# EAGLE schematic masterV05a (EAGLE 6.1), part 1 of 2

## Sheet 1 of 11
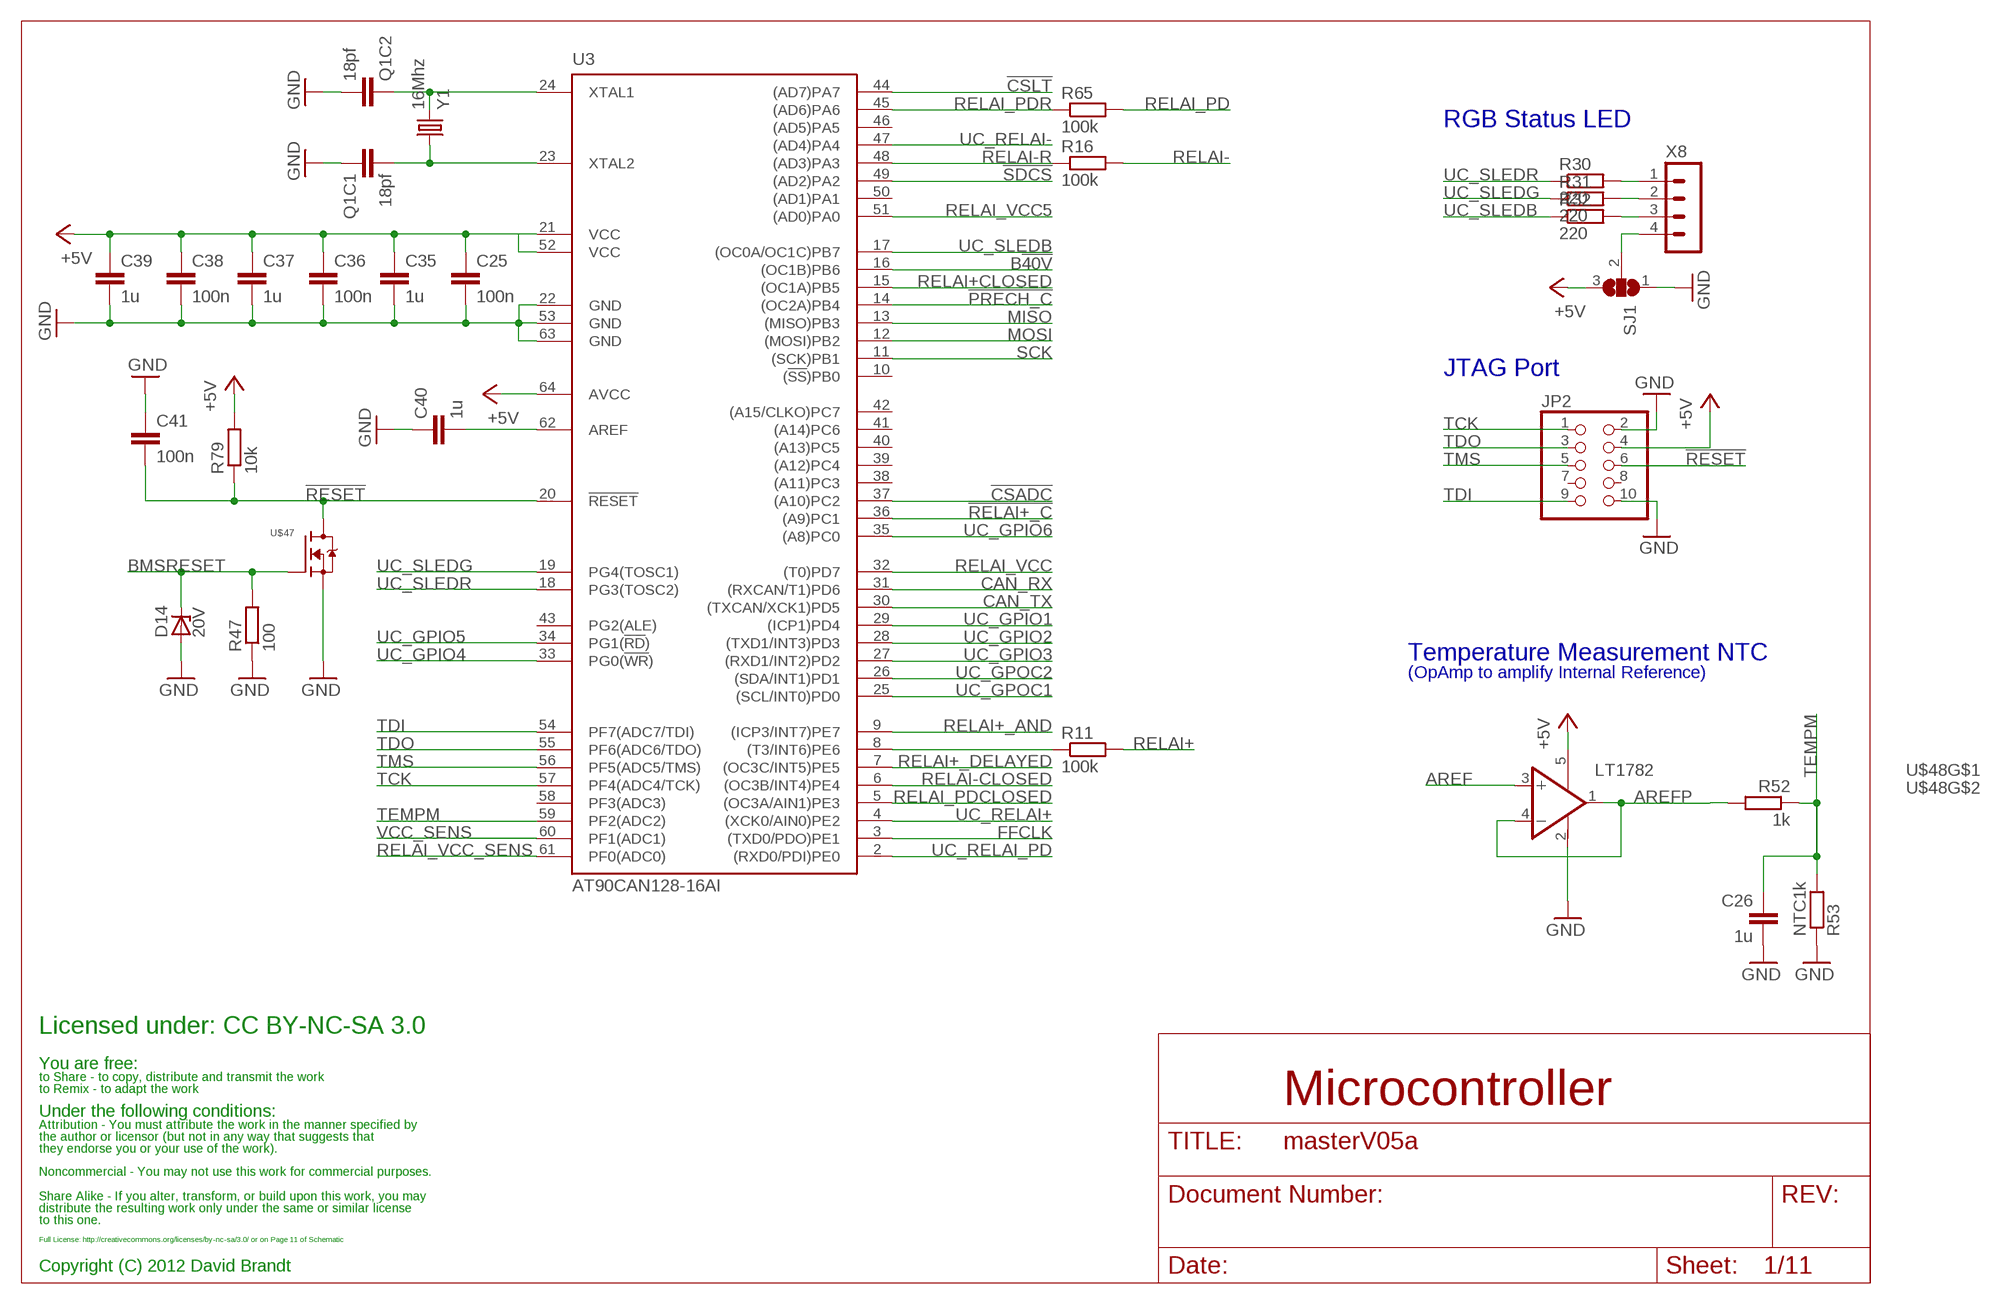
[diagram p0: schematic, sheet 1]

### Parts
C25  100n  C-EUC0603K  [C0603K]
C26  1u  C-EUC0603  [C0603]
C35  1u  C-EUC0603K  [C0603K]
C36  100n  C-EUC0603K  [C0603K]
C37  1u  C-EUC0603K  [C0603K]
C38  100n  C-EUC0603K  [C0603K]
C39  1u  C-EUC0603K  [C0603K]
C40  1u  C-EUC0603K  [C0603K]
C41  100n  C-EUC0603K  [C0603K]
D14  20V  ZENER-DIODESOD123  [SOD123]
JP2  PINHD-2X5  [2X05]
Q1C1  18pf  C-EUC0603K  [C0603K]
Q1C2  18pf  C-EUC0603K  [C0603K]
R11  100k  R-EU_R0603  [R0603]
R16  100k  R-EU_R0603  [R0603]
R30  220  R-EU_R0805  [R0805]
R31  220  R-EU_R0805  [R0805]
R32  220  R-EU_R0805  [R0805]
R47  100  R-EU_R0603  [R0603]
R52  1k  R-EU_R0603  [R0603]
R53  NTC1k  R-EU_R0603  [R0603]
R65  100k  R-EU_R0603  [R0603]
R79  10k  R-EU_R0603  [R0603]
SJ1  SJ2W  [SJ_2]
U3  AT90CAN128-16AI  [TQFP64-0.8MM]
U$47  2N7002  [SOT23]
U$48  LT1782  [SOT23-5]
X8  HEADER_POS4_43045-0412  [43045-0412]
Y1  16Mhz  CRYSTALCX-53G  [CX-53G]

### Nets
!CSADC: U3.37((A10)PC2) ; also sheet 7
!CSLT: U3.44((AD7)PA7) ; also sheet 6
!PRECH_C: U3.14((OC2A)PB4) ; also sheet 3,9
!RELAI+_C: U3.36((A9)PC1) ; also sheet 3
!RESET: C41.2 JP2.6 R79.1 U3.20(!RESET) U$47.3(D)
!SDCS: U3.49((AD2)PA2) ; also sheet 10
+5V: C25.1 C35.1 C36.1 C37.1 C38.1 C39.1 JP2.4 R79.2 SJ1.3 U3.21(VCC) U3.52(VCC) U3.64(AVCC) U$48.5(V+) ; also sheet 2,3,4,5,6,7,8,9,10
AREF: C40.2 U3.62(AREF) U$48.3(+IN)
AREFP: R52.2 U$48.1(OUT) U$48.4(-IN)
B!40V: U3.16((OC1B)PB6) ; also sheet 3,4,8
BMSRESET: D14.C R47.2 U$47.1(G) ; also sheet 2
CAN_RX: U3.31((RXCAN/T1)PD6) ; also sheet 5
CAN_TX: U3.30((TXCAN/XCK1)PD5) ; also sheet 5
FFCLK: U3.3((TXD0/PDO)PE1) ; also sheet 3
GND: C25.2 C26.2 C35.2 C36.2 C37.2 C38.2 C39.2 C40.1 C41.1 D14.A JP2.2 JP2.10 Q1C1.1 Q1C2.2 R47.1 R53.1 SJ1.1 U3.22(GND) U3.53(GND) U3.63(GND) U$47.2(S) U$48.2(V-) ; also sheet 2,3,4,5,6,7,8,9,10
MISO: U3.13((MISO)PB3) ; also sheet 6,7,10
MOSI: U3.12((MOSI)PB2) ; also sheet 6,10
OSC1: Q1C2.1 U3.24(XTAL1) Y1.P$2
OSC2: Q1C1.2 U3.23(XTAL2) Y1.P$1
RELAI+: R11.2 ; also sheet 3,4
RELAI+_AND: U3.9((ICP3/INT7)PE7) ; also sheet 3
RELAI+_DELAYED: U3.7((OC3C/INT5)PE5) ; also sheet 3
RELAI+CLOSED: U3.15((OC1A)PB5) ; also sheet 4
RELAI+S: R11.1 U3.8((T3/INT6)PE6)
RELAI-: R16.2 ; also sheet 3,4
RELAI-CLOSED: U3.6((OC3B/INT4)PE4) ; also sheet 3,4
RELAI-R: R16.1 U3.48((AD3)PA3)
RELAI_PD: R65.2 ; also sheet 3,4
RELAI_PDCLOSED: U3.5((OC3A/AIN1)PE3) ; also sheet 3,4
RELAI_PDR: R65.1 U3.45((AD6)PA6)
RELAI_VCC: U3.32((T0)PD7)
RELAI_VCC5: U3.51((AD0)PA0) ; also sheet 2,3
RELAI_VCC_SENS: U3.61(PF0(ADC0)) ; also sheet 2
SCK: U3.11((SCK)PB1) ; also sheet 6,7,10
SLEDB: R32.2 X8.3
SLEDG: R31.2 X8.2
SLEDPOW: SJ1.2 X8.4
SLEDR: R30.2 X8.1
TCK: JP2.1 U3.57(PF4(ADC4/TCK))
TDI: JP2.9 U3.54(PF7(ADC7/TDI))
TDO: JP2.3 U3.55(PF6(ADC6/TDO))
TEMPM: C26.1 R52.1 R53.2 U3.59(PF2(ADC2))
TMS: JP2.5 U3.56(PF5(ADC5/TMS))
UC_GPIO1: U3.29((ICP1)PD4) ; also sheet 2
UC_GPIO2: U3.28((TXD1/INT3)PD3) ; also sheet 2
UC_GPIO3: U3.27((RXD1/INT2)PD2) ; also sheet 2
UC_GPIO4: U3.33(PG0(!WR!)) ; also sheet 2
UC_GPIO5: U3.34(PG1(!RD!)) ; also sheet 2
UC_GPIO6: U3.35((A8)PC0) ; also sheet 2
UC_GPOC1: U3.25((SCL/INT0)PD0) ; also sheet 2
UC_GPOC2: U3.26((SDA/INT1)PD1) ; also sheet 2
UC_RELAI+: U3.4((XCK0/AIN0)PE2) ; also sheet 3
UC_RELAI-: U3.47((AD4)PA4) ; also sheet 3
UC_RELAI_PD: U3.2((RXD0/PDI)PE0) ; also sheet 3
UC_SLEDB: R32.1 U3.17((OC0A/OC1C)PB7)
UC_SLEDG: R31.1 U3.19(PG4(TOSC1))
UC_SLEDR: R30.1 U3.18(PG3(TOSC2))
VCC_SENS: U3.60(PF1(ADC1)) ; also sheet 2
Unconnected: JP2.7 JP2.8 U3.10((!SS!)PB0) U3.38((A11)PC3) U3.39((A12)PC4) U3.40((A13)PC5) U3.41((A14)PC6) U3.42((A15/CLKO)PC7) U3.43(PG2(ALE)) U3.46((AD5)PA5) U3.50((AD1)PA1) U3.58(PF3(ADC3))

### Notes on the sheet
- RGB Status LED
- JTAG Port
- Temperature Measurement NTC
- (OpAmp to amplify Internal Reference)
- Licensed under: CC BY-NC-SA 3.0
- You are free:
- to Share - to copy, distribute and transmit the work
- to Remix - to adapt the work
- Microcontroller
- Under the following conditions:
- Attribution - You must attribute the work in the manner specified by
- the author or licensor (but not in any way that suggests that
- they endorse you or your use of the work).
- Noncommercial - You may not use this work for commercial purposes.
- Share Alike - If you alter, transform, or build upon this work, you may
- distribute the resulting work only under the same or similar license
- to this one.
- Full License: http://creativecommons.org/licenses/by-nc-sa/3.0/ or on Page 11 of Schematic
- Copyright (C) 2012 David Brandt

## Sheet 2 of 11
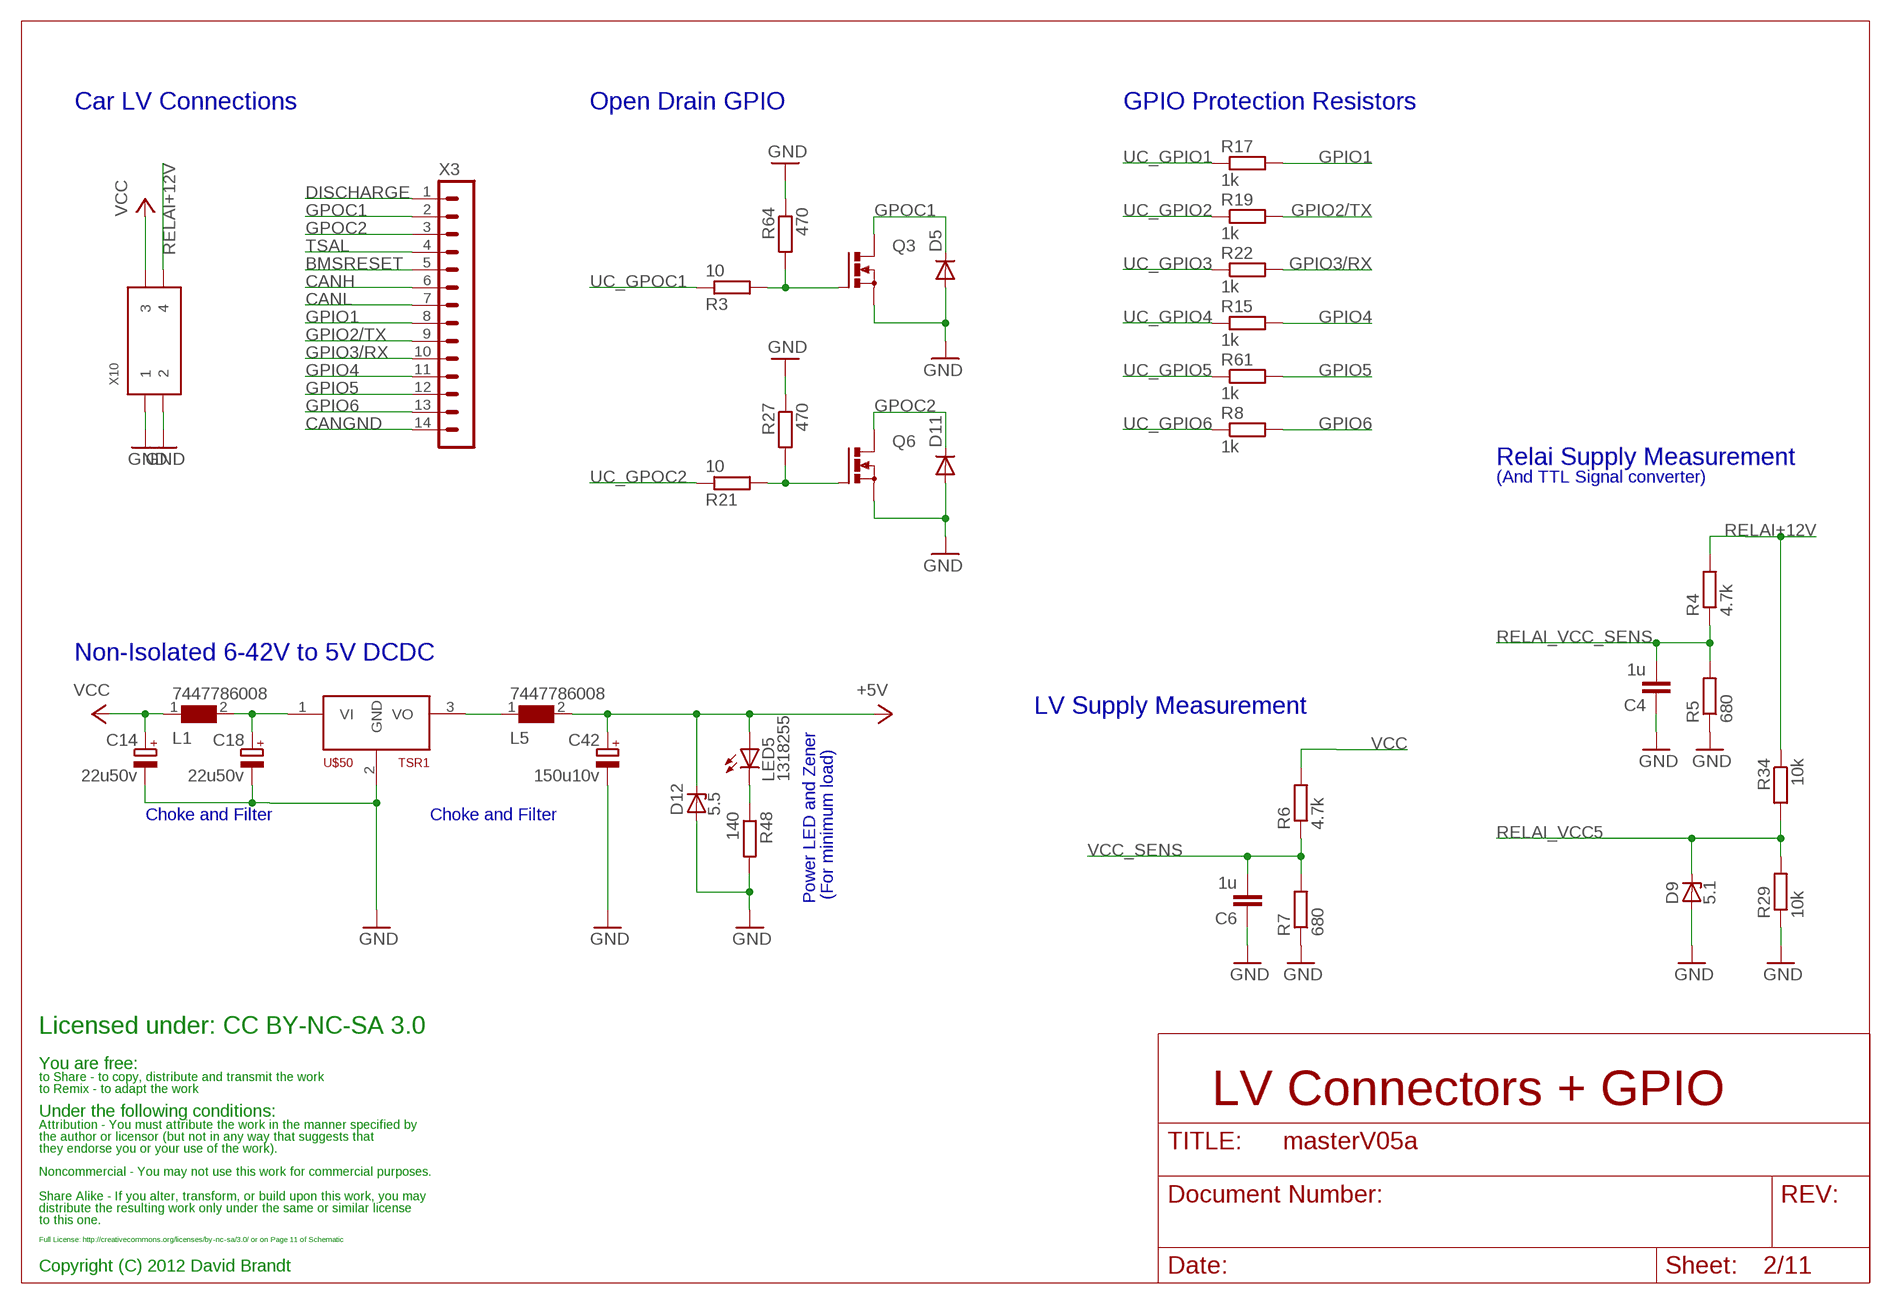
[diagram p1: schematic, sheet 2]

### Parts
C4  1u  C-EUC0603  [C0603]
C6  1u  C-EUC0603  [C0603]
C14  22u50v  CPOL-EUD  [PANASONIC_D]
C18  22u50v  CPOL-EUD  [PANASONIC_D]
C42  150u10v  CPOL-EUD  [PANASONIC_D]
D5  DIODE-SMB  [SMB]
D9  5.1  ZENER-DIODESOD323  [SOD323-W]
D11  DIODE-SMB  [SMB]
D12  5.5  ZENER-DIODESOD323  [SOD323-W]
L1  7447786008  WE-PD_6033/6050_PLASTIC_BASE  [WE-PD_6033/6050_PLASTIC_BASE]
L5  7447786008  WE-PD_6033/6050_PLASTIC_BASE  [WE-PD_6033/6050_PLASTIC_BASE]
LED5  1318255  LEDCHIPLED_1206  [CHIPLED_1206]
Q3  N-MOSFET-SO8S  [SO-08]
Q6  N-MOSFET-SO8S  [SO-08]
R3  10  R-EU_R0603  [R0603]
R4  4.7k  R-EU_R0603  [R0603]
R5  680  R-EU_R0603  [R0603]
R6  4.7k  R-EU_R0603  [R0603]
R7  680  R-EU_R0603  [R0603]
R8  1k  R-EU_R0603  [R0603]
R15  1k  R-EU_R0603  [R0603]
R17  1k  R-EU_R0603  [R0603]
R19  1k  R-EU_R0603  [R0603]
R21  10  R-EU_R0603  [R0603]
R22  1k  R-EU_R0603  [R0603]
R27  470  R-EU_R0603  [R0603]
R29  10k  R-EU_R0603  [R0603]
R34  10k  R-EU_R0603  [R0603]
R48  140  R-EU_R1206  [R1206]
R61  1k  R-EU_R0603  [R0603]
R64  470  R-EU_R0603  [R0603]
U$50  TSR1  [TSR1]
X3  HEADER_POS14_43045-1412  [43045-1412]
X10  MINI-FIT-JR-045566  [5566-04]

### Nets
+5V: C42.+ D12.C L5.2 LED5.A ; also sheet 1,3,4,5,6,7,8,9,10
+5VL: L5.1 U$50.3(VO)
BMSRESET: X3.5 ; also sheet 1
CANGND: X3.14 ; also sheet 5
CANH: X3.6 ; also sheet 5
CANL: X3.7 ; also sheet 5
DISCHARGE: X3.1 ; also sheet 4
GND: C4.1 C6.1 C14.- C18.- C42.- D5.A D9.A D11.A D12.A Q3.1(S) Q3.2(S) Q3.3(S) Q6.1(S) Q6.2(S) Q6.3(S) R5.1 R7.1 R27.1 R29.1 R48.2 R64.1 U$50.2(GND) X10.P1 X10.P2 ; also sheet 1,3,4,5,6,7,8,9,10
GPIO1: R17.2 X3.8
GPIO2/TX: R19.2 X3.9
GPIO3/RX: R22.2 X3.10
GPIO4: R15.2 X3.11
GPIO5: R61.2 X3.12
GPIO6: R8.2 X3.13
GPOC1: D5.C Q3.5(D) Q3.6(D) Q3.7(D) Q3.8(D) X3.2
GPOC2: D11.C Q6.5(D) Q6.6(D) Q6.7(D) Q6.8(D) X3.3
PLEDC5: LED5.C R48.1
RELAI+12V: R4.2 R34.1 X10.P4 ; also sheet 4
RELAI_VCC5: D9.C R29.2 R34.2 ; also sheet 1,3
RELAI_VCC_SENS: C4.2 R4.1 R5.2 ; also sheet 1
RELAIPDG1: Q3.4(G) R3.2 R64.2
RELAIPDG2: Q6.4(G) R21.2 R27.2
TSAL: X3.4 ; also sheet 4
UC_GPIO1: R17.1 ; also sheet 1
UC_GPIO2: R19.1 ; also sheet 1
UC_GPIO3: R22.1 ; also sheet 1
UC_GPIO4: R15.1 ; also sheet 1
UC_GPIO5: R61.1 ; also sheet 1
UC_GPIO6: R8.1 ; also sheet 1
UC_GPOC1: R3.1 ; also sheet 1
UC_GPOC2: R21.1 ; also sheet 1
VCC: C14.+ L1.1 R6.2 X10.P3
VCC2: C18.+ L1.2 U$50.1(VI)
VCC_SENS: C6.2 R6.1 R7.2 ; also sheet 1

### Notes on the sheet
- Car LV Connections | Open Drain GPIO | GPIO Protection Resistors
- Relai Supply Measurement
- (And TTL Signal converter)
- Non-Isolated 6-42V to 5V DCDC
- LV Supply Measurement
- Power LED and Zener
- (For minimum load)
- Choke and Filter | Choke and Filter
- Licensed under: CC BY-NC-SA 3.0
- You are free:
- to Share - to copy, distribute and transmit the work
- to Remix - to adapt the work
- LV Connectors + GPIO
- Under the following conditions:
- Attribution - You must attribute the work in the manner specified by
- the author or licensor (but not in any way that suggests that
- they endorse you or your use of the work).
- Noncommercial - You may not use this work for commercial purposes.
- Share Alike - If you alter, transform, or build upon this work, you may
- distribute the resulting work only under the same or similar license
- to this one.
- Full License: http://creativecommons.org/licenses/by-nc-sa/3.0/ or on Page 11 of Schematic
- Copyright (C) 2012 David Brandt

## Sheet 3 of 11
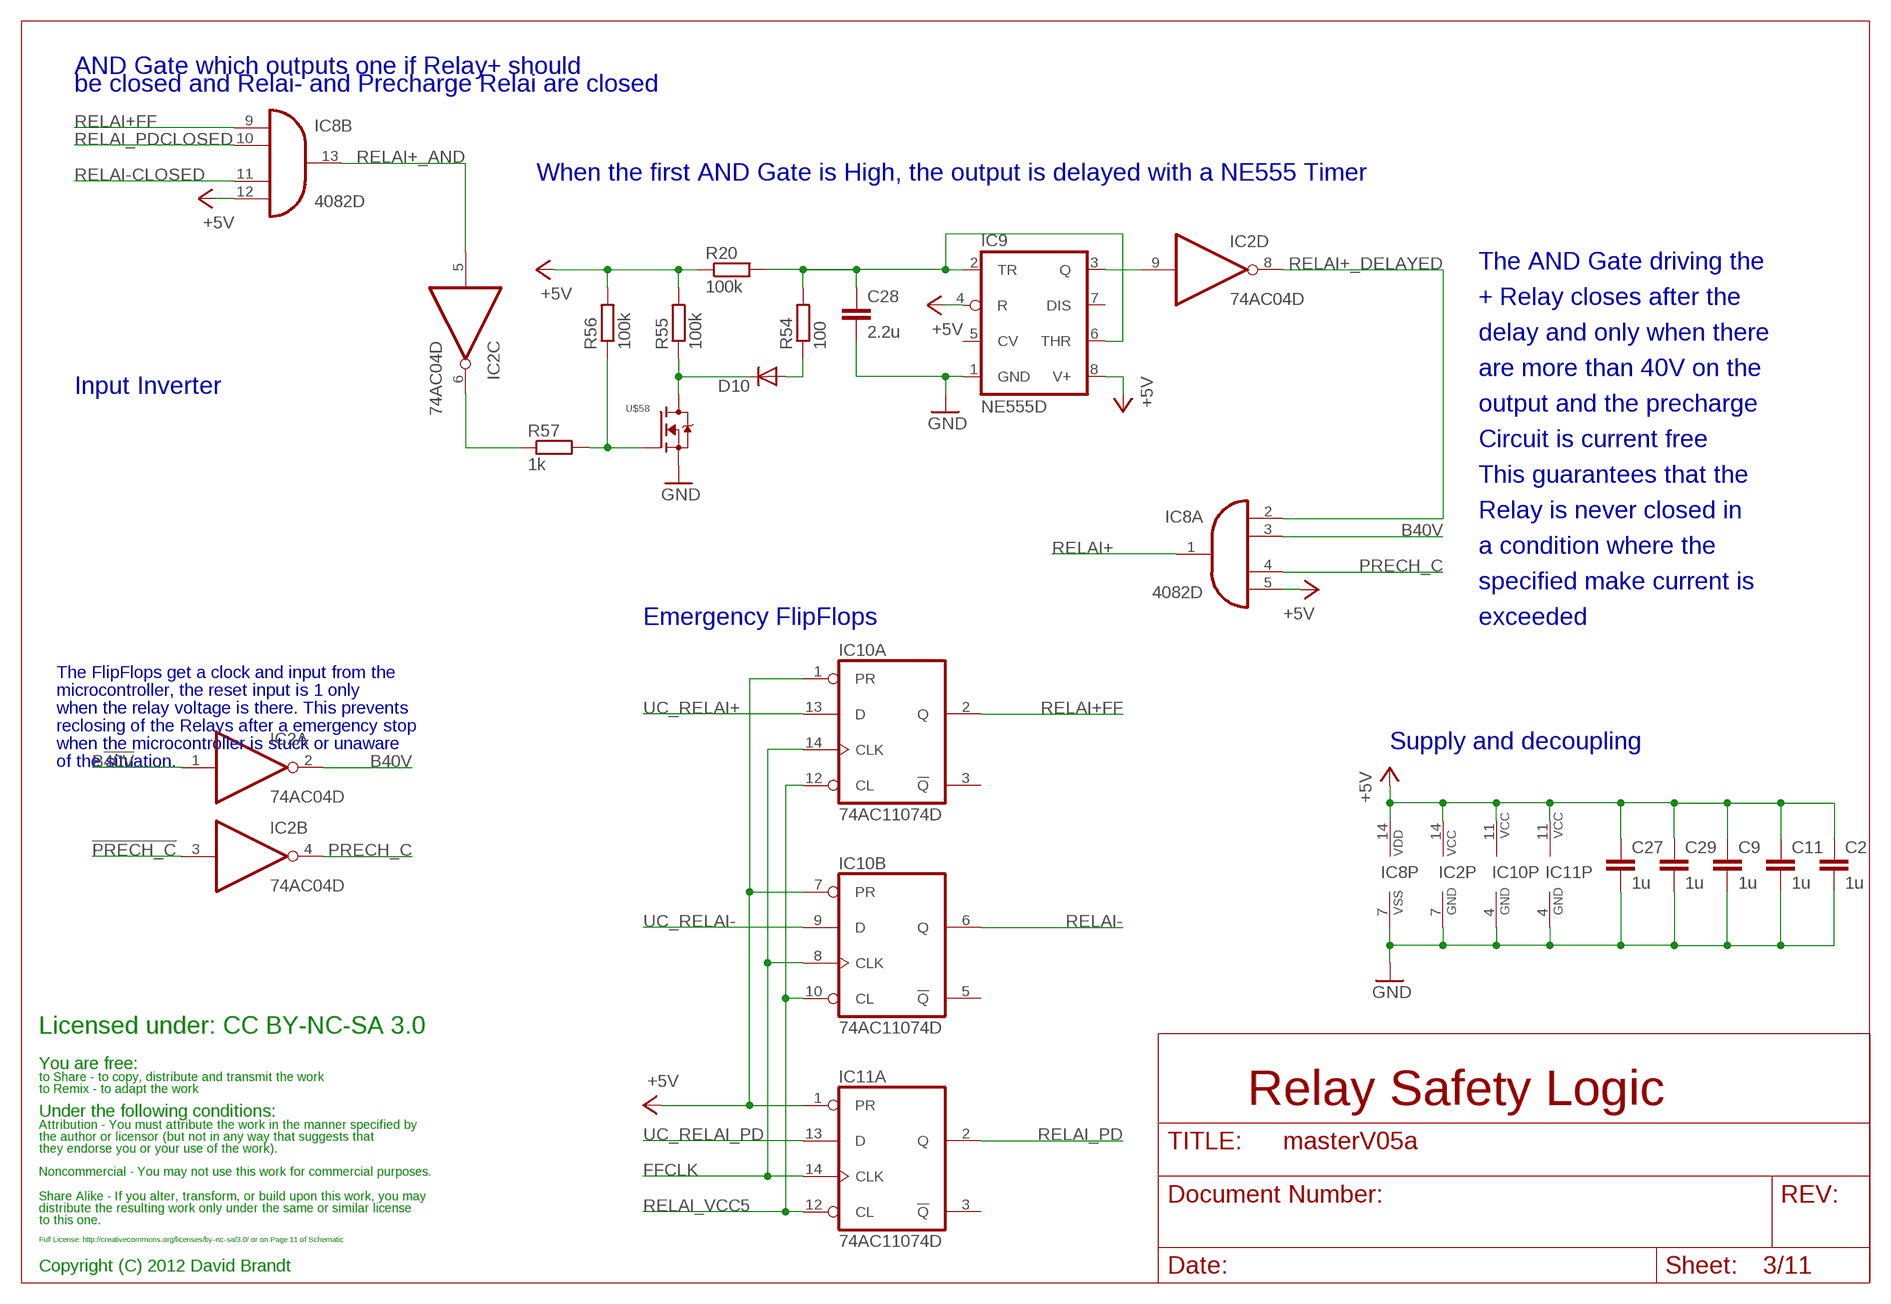
[diagram p2: schematic, sheet 3]

### Parts
C2  1u  C-EUC0603  [C0603]
C9  1u  C-EUC0603  [C0603]
C11  1u  C-EUC0603  [C0603]
C27  1u  C-EUC0603  [C0603]
C28  2.2u  C-EUC1206K  [C1206K]
C29  1u  C-EUC0603  [C0603]
D10  DIODE-SOD323-W  [SOD323-W]
IC2  74AC04D  [SO14]
IC8  4082D  [SO14]
IC9  NE555D  [SO08]
IC10  74AC11074D  [SO14]
IC11  74AC11074D  [SO14]
R20  100k  R-EU_R0603  [R0603]
R54  100  R-EU_R0603  [R0603]
R55  100k  R-EU_R0603  [R0603]
R56  100k  R-EU_R0603  [R0603]
R57  1k  R-EU_R0603  [R0603]
U$58  2N7002  [SOT23]

### Nets
!ANDOUT2: D10.C R55.1 U$58.3(D)
!PRECH_C: IC2.3(B:I) ; also sheet 1,9
!RELAI+_C: IC2.6(C:O) R57.1 ; also sheet 1
!RELAI+_CC: IC2.9(D:I) IC9.3(Q)
+5V: C2.1 C9.1 C11.1 C27.1 C29.1 IC2.14(P:VCC) IC8.5(A:I3) IC8.12(B:I3) IC8.14(P:VDD) IC9.4(R) IC9.8(V+) IC10.1(A:PR) IC10.7(B:PR) IC10.11(P:VCC) IC11.1(A:PR) IC11.11(P:VCC) R20.1 R55.2 R56.2 ; also sheet 1,2,4,5,6,7,8,9,10
ANDOUTD: D10.A R54.1
B40V: IC2.2(A:O) IC8.3(A:I1)
B!40V: IC2.1(A:I) ; also sheet 1,4,8
FFCLK: IC10.8(B:CLK) IC10.14(A:CLK) IC11.14(A:CLK) ; also sheet 1
GND: C2.2 C9.2 C11.2 C27.2 C28.2 C29.2 IC2.7(P:GND) IC8.7(P:VSS) IC9.1(GND) IC10.4(P:GND) IC11.4(P:GND) U$58.2(S) ; also sheet 1,2,4,5,6,7,8,9,10
NE555_TR: C28.1 IC9.2(TR) IC9.6(THR) R20.2 R54.2
PRECH_C: IC2.4(B:O) IC8.4(A:I2)
RELAI+: IC8.1(A:O) ; also sheet 1,4
RELAI+_AND: IC2.5(C:I) IC8.13(B:O) ; also sheet 1
RELAI+_CG: R56.1 R57.2 U$58.1(G)
RELAI+_DELAYED: IC2.8(D:O) IC8.2(A:I0) ; also sheet 1
RELAI+FF: IC8.9(B:I0) IC10.2(A:Q)
RELAI-: IC10.6(B:Q) ; also sheet 1,4
RELAI-CLOSED: IC8.11(B:I2) ; also sheet 1,4
RELAI_PD: IC11.2(A:Q) ; also sheet 1,4
RELAI_PDCLOSED: IC8.10(B:I1) ; also sheet 1,4
RELAI_VCC5: IC10.10(B:CL) IC10.12(A:CL) IC11.12(A:CL) ; also sheet 1,2
UC_RELAI+: IC10.13(A:D) ; also sheet 1
UC_RELAI-: IC10.9(B:D) ; also sheet 1
UC_RELAI_PD: IC11.13(A:D) ; also sheet 1
Unconnected: IC2.10(E:O) IC2.11(E:I) IC2.12(F:O) IC2.13(F:I) IC9.5(CV) IC9.7(DIS) IC10.3(A:!Q) IC10.5(B:!Q) IC11.3(A:!Q) IC11.5(B:!Q) IC11.6(B:Q) IC11.7(B:PR) IC11.8(B:CLK) IC11.9(B:D) IC11.10(B:CL)

### Notes on the sheet
- AND Gate which outputs one if Relay+ should
- be closed and Relai- and Precharge Relai are closed
- When the first AND Gate is High, the output is delayed with a NE555 Timer
- The AND Gate driving the
- + Relay closes after the
- delay and only when there
- are more than 40V on the
- Input Inverter
- output and the precharge
- Circuit is current free
- This guarantees that the
- Relay is never closed in
- a condition where the
- specified make current is
- Emergency FlipFlops | exceeded
- The FlipFlops get a clock and input from the
- microcontroller, the reset input is 1 only
- when the relay voltage is there. This prevents
- reclosing of the Relays after a emergency stop
- when the microcontroller is stuck or unaware | Supply and decoupling
- of the situation.
- Licensed under: CC BY-NC-SA 3.0
- You are free:
- to Share - to copy, distribute and transmit the work
- to Remix - to adapt the work
- Relay Safety Logic
- Under the following conditions:
- Attribution - You must attribute the work in the manner specified by
- the author or licensor (but not in any way that suggests that
- they endorse you or your use of the work).
- Noncommercial - You may not use this work for commercial purposes.
- Share Alike - If you alter, transform, or build upon this work, you may
- distribute the resulting work only under the same or similar license
- to this one.
- Full License: http://creativecommons.org/licenses/by-nc-sa/3.0/ or on Page 11 of Schematic
- Copyright (C) 2012 David Brandt

## Sheet 4 of 11
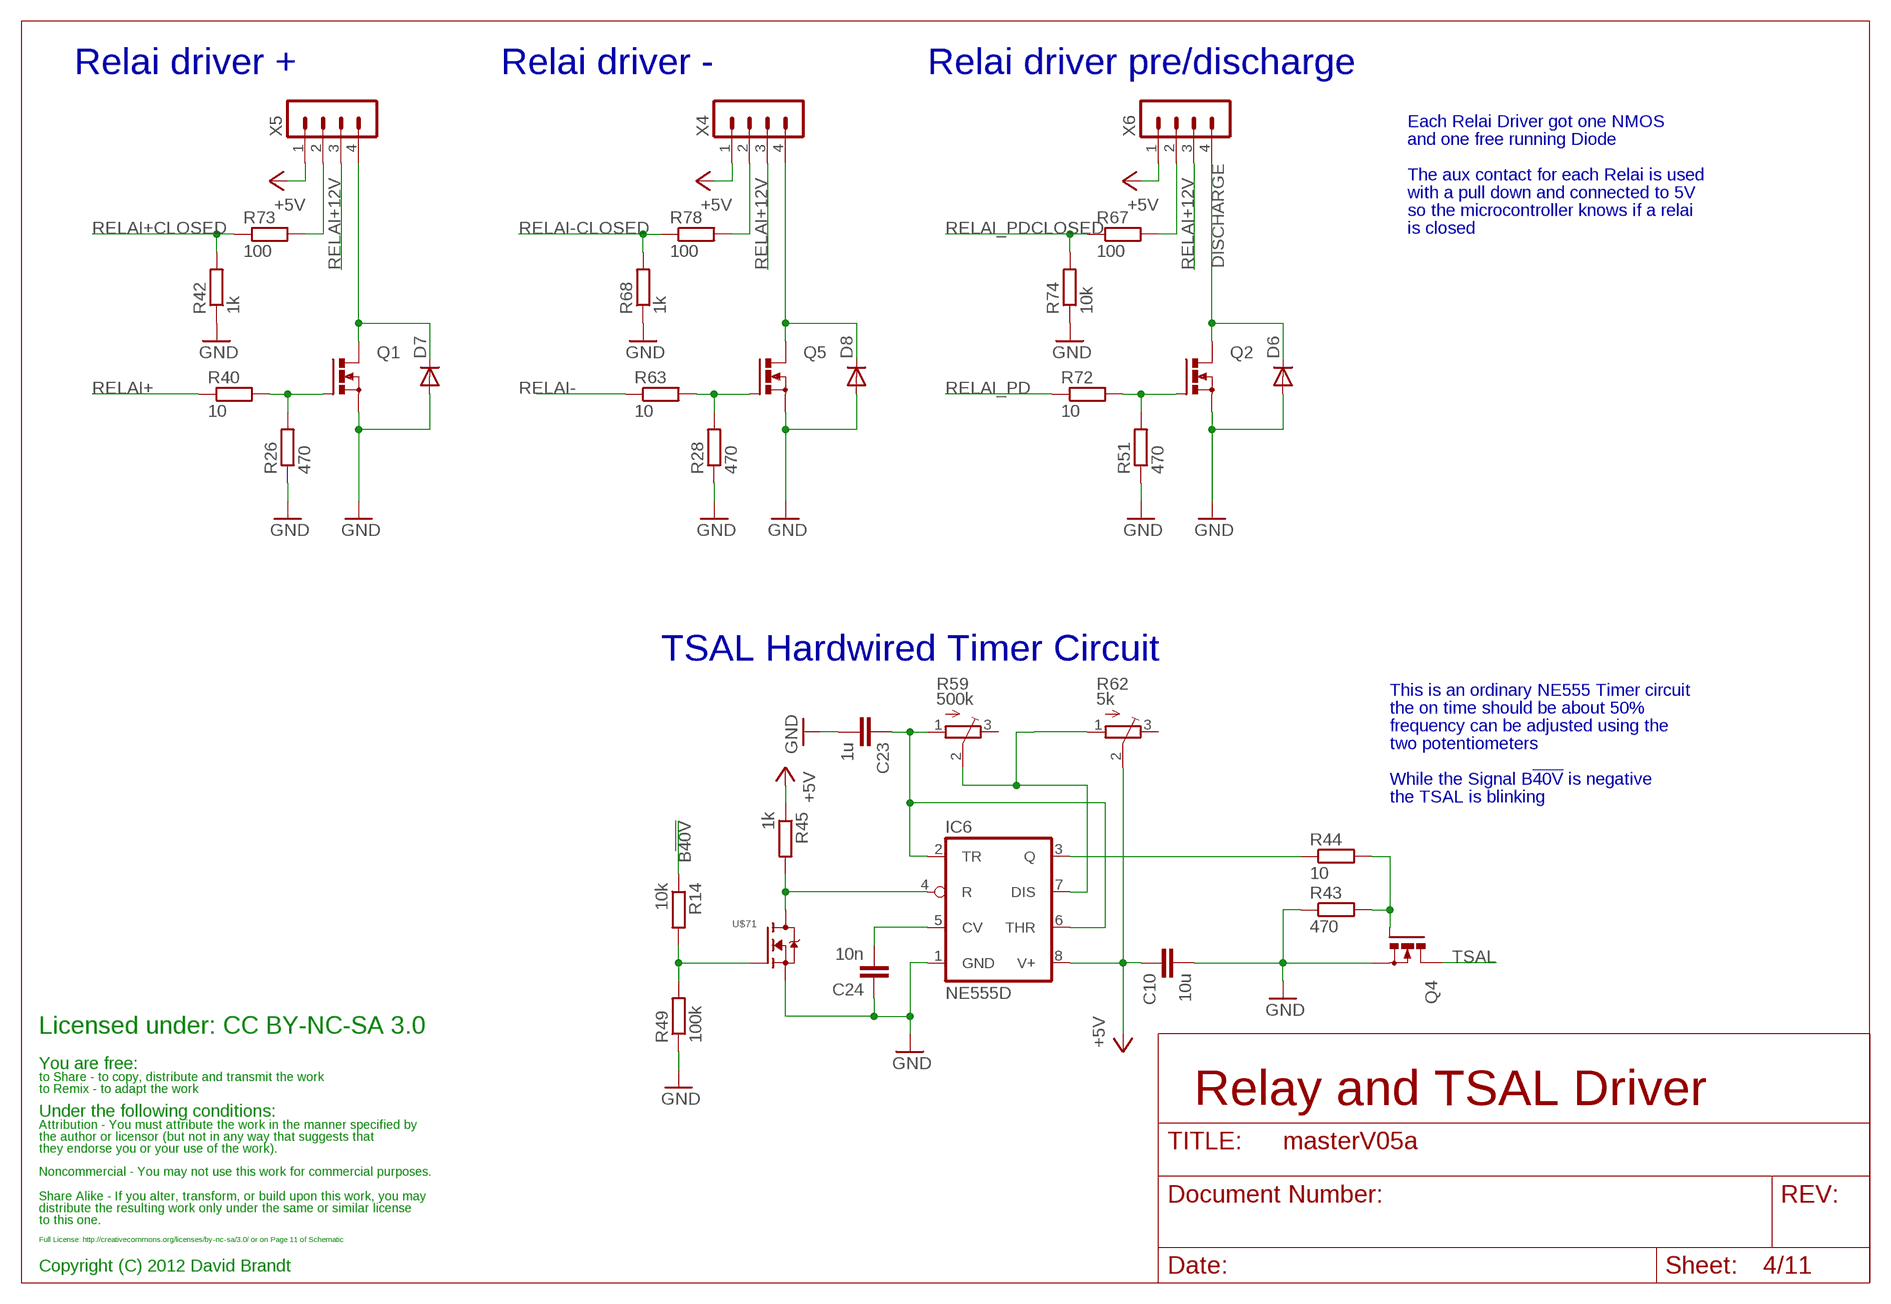
[diagram p3: schematic, sheet 4]

### Parts
C10  10u  C-EUC1206K  [C1206K]
C23  1u  C-EUC0805K  [C0805K]
C24  10n  C-EUC0603  [C0603]
D6  DIODE-SMB  [SMB]
D7  DIODE-SMB  [SMB]
D8  DIODE-SMB  [SMB]
IC6  NE555D  [SO08]
Q1  N-MOSFET-SO8S  [SO-08]
Q2  N-MOSFET-SO8S  [SO-08]
Q4  N-MOSFET-SO8S  [SO-08]
Q5  N-MOSFET-SO8S  [SO-08]
R14  10k  R-EU_R0603  [R0603]
R26  470  R-EU_R0603  [R0603]
R28  470  R-EU_R0603  [R0603]
R40  10  R-EU_R0603  [R0603]
R42  1k  R-EU_R0603  [R0603]
R43  470  R-EU_R0603  [R0603]
R44  10  R-EU_R0603  [R0603]
R45  1k  R-EU_R0603  [R0603]
R49  100k  R-EU_R0603  [R0603]
R51  470  R-EU_R0603  [R0603]
R59  500k  TRIM_EU-3223W  [3223W]
R62  5k  TRIM_EU-3223W  [3223W]
R63  10  R-EU_R0603  [R0603]
R67  100  R-EU_R0603  [R0603]
R68  1k  R-EU_R0603  [R0603]
R72  10  R-EU_R0603  [R0603]
R73  100  R-EU_R0603  [R0603]
R74  10k  R-EU_R0603  [R0603]
R78  100  R-EU_R0603  [R0603]
U$71  2N7002  [SOT23]
X4  HEADER_POS4_43045-0412  [43045-0412]
X5  HEADER_POS4_43045-0412  [43045-0412]
X6  HEADER_POS4_43045-0412  [43045-0412]

### Nets
+5V: C10.1 IC6.8(V+) R45.1 R62.2(S) X4.1 X5.1 X6.1 ; also sheet 1,2,3,5,6,7,8,9,10
B!40V: R14.1 ; also sheet 1,3,8
DISCHARGE: D6.C Q2.5(D) Q2.6(D) Q2.7(D) Q2.8(D) X6.4 ; also sheet 2
GND: C10.2 C23.2 C24.1 D6.A D7.A D8.A IC6.1(GND) Q1.1(S) Q1.2(S) Q1.3(S) Q2.1(S) Q2.2(S) Q2.3(S) Q4.1(S) Q4.2(S) Q4.3(S) Q5.1(S) Q5.2(S) Q5.3(S) R26.1 R28.1 R42.1 R43.1 R49.1 R51.1 R68.1 R74.1 U$71.2(S) ; also sheet 1,2,3,5,6,7,8,9,10
RELAI+: R40.1 ; also sheet 1,3
RELAI+12V: X4.3 X5.3 X6.3 ; also sheet 2
RELAI+_CLOSED_AP: R73.2 X5.2
RELAI+CLOSED: R42.2 R73.1 ; also sheet 1
RELAI+G: Q1.4(G) R26.2 R40.2
RELAI+GND: D7.C Q1.5(D) Q1.6(D) Q1.7(D) Q1.8(D) X5.4
RELAI-: R63.1 ; also sheet 1,3
RELAI-_CLOSED_AP: R78.2 X4.2
RELAI-CLOSED: R68.2 R78.1 ; also sheet 1,3
RELAI-G: Q5.4(G) R28.2 R63.2
RELAI-GND: D8.C Q5.5(D) Q5.6(D) Q5.7(D) Q5.8(D) X4.4
RELAI_PD: R72.1 ; also sheet 1,3
RELAI_PDCLOSED: R67.1 R74.2 ; also sheet 1,3
RELAIPD_CLOSED_AP: R67.2 X6.2
RELAIPDG: Q2.4(G) R51.2 R72.2
TSAL: Q4.5(D) Q4.6(D) Q4.7(D) Q4.8(D) ; also sheet 2
TSAL!R: IC6.4(R) R45.2 U$71.3(D)
TSALCV: C24.2 IC6.5(CV)
TSALDIS: IC6.7(DIS) R59.2(S) R62.1(A)
TSALG: Q4.4(G) R43.2 R44.2
TSALGOUT: R14.2 R49.2 U$71.1(G)
TSALPR: C23.1 IC6.2(TR) IC6.6(THR) R59.1(A)
TSALQ: IC6.3(Q) R44.1
Unconnected: R59.3(E) R62.3(E)

### Notes on the sheet
- Relai driver + | Relai driver - | Relai driver pre/discharge
- Each Relai Driver got one NMOS
- and one free running Diode
- The aux contact for each Relai is used
- with a pull down and connected to 5V
- so the microcontroller knows if a relai
- is closed
- TSAL Hardwired Timer Circuit
- This is an ordinary NE555 Timer circuit
- the on time should be about 50%
- frequency can be adjusted using the
- two potentiometers
- While the Signal B!40V! is negative
- the TSAL is blinking
- Licensed under: CC BY-NC-SA 3.0
- You are free:
- to Share - to copy, distribute and transmit the work
- to Remix - to adapt the work
- Relay and TSAL Driver
- Under the following conditions:
- Attribution - You must attribute the work in the manner specified by
- the author or licensor (but not in any way that suggests that
- they endorse you or your use of the work).
- Noncommercial - You may not use this work for commercial purposes.
- Share Alike - If you alter, transform, or build upon this work, you may
- distribute the resulting work only under the same or similar license
- to this one.
- Full License: http://creativecommons.org/licenses/by-nc-sa/3.0/ or on Page 11 of Schematic
- Copyright (C) 2012 David Brandt

## Sheet 5 of 11
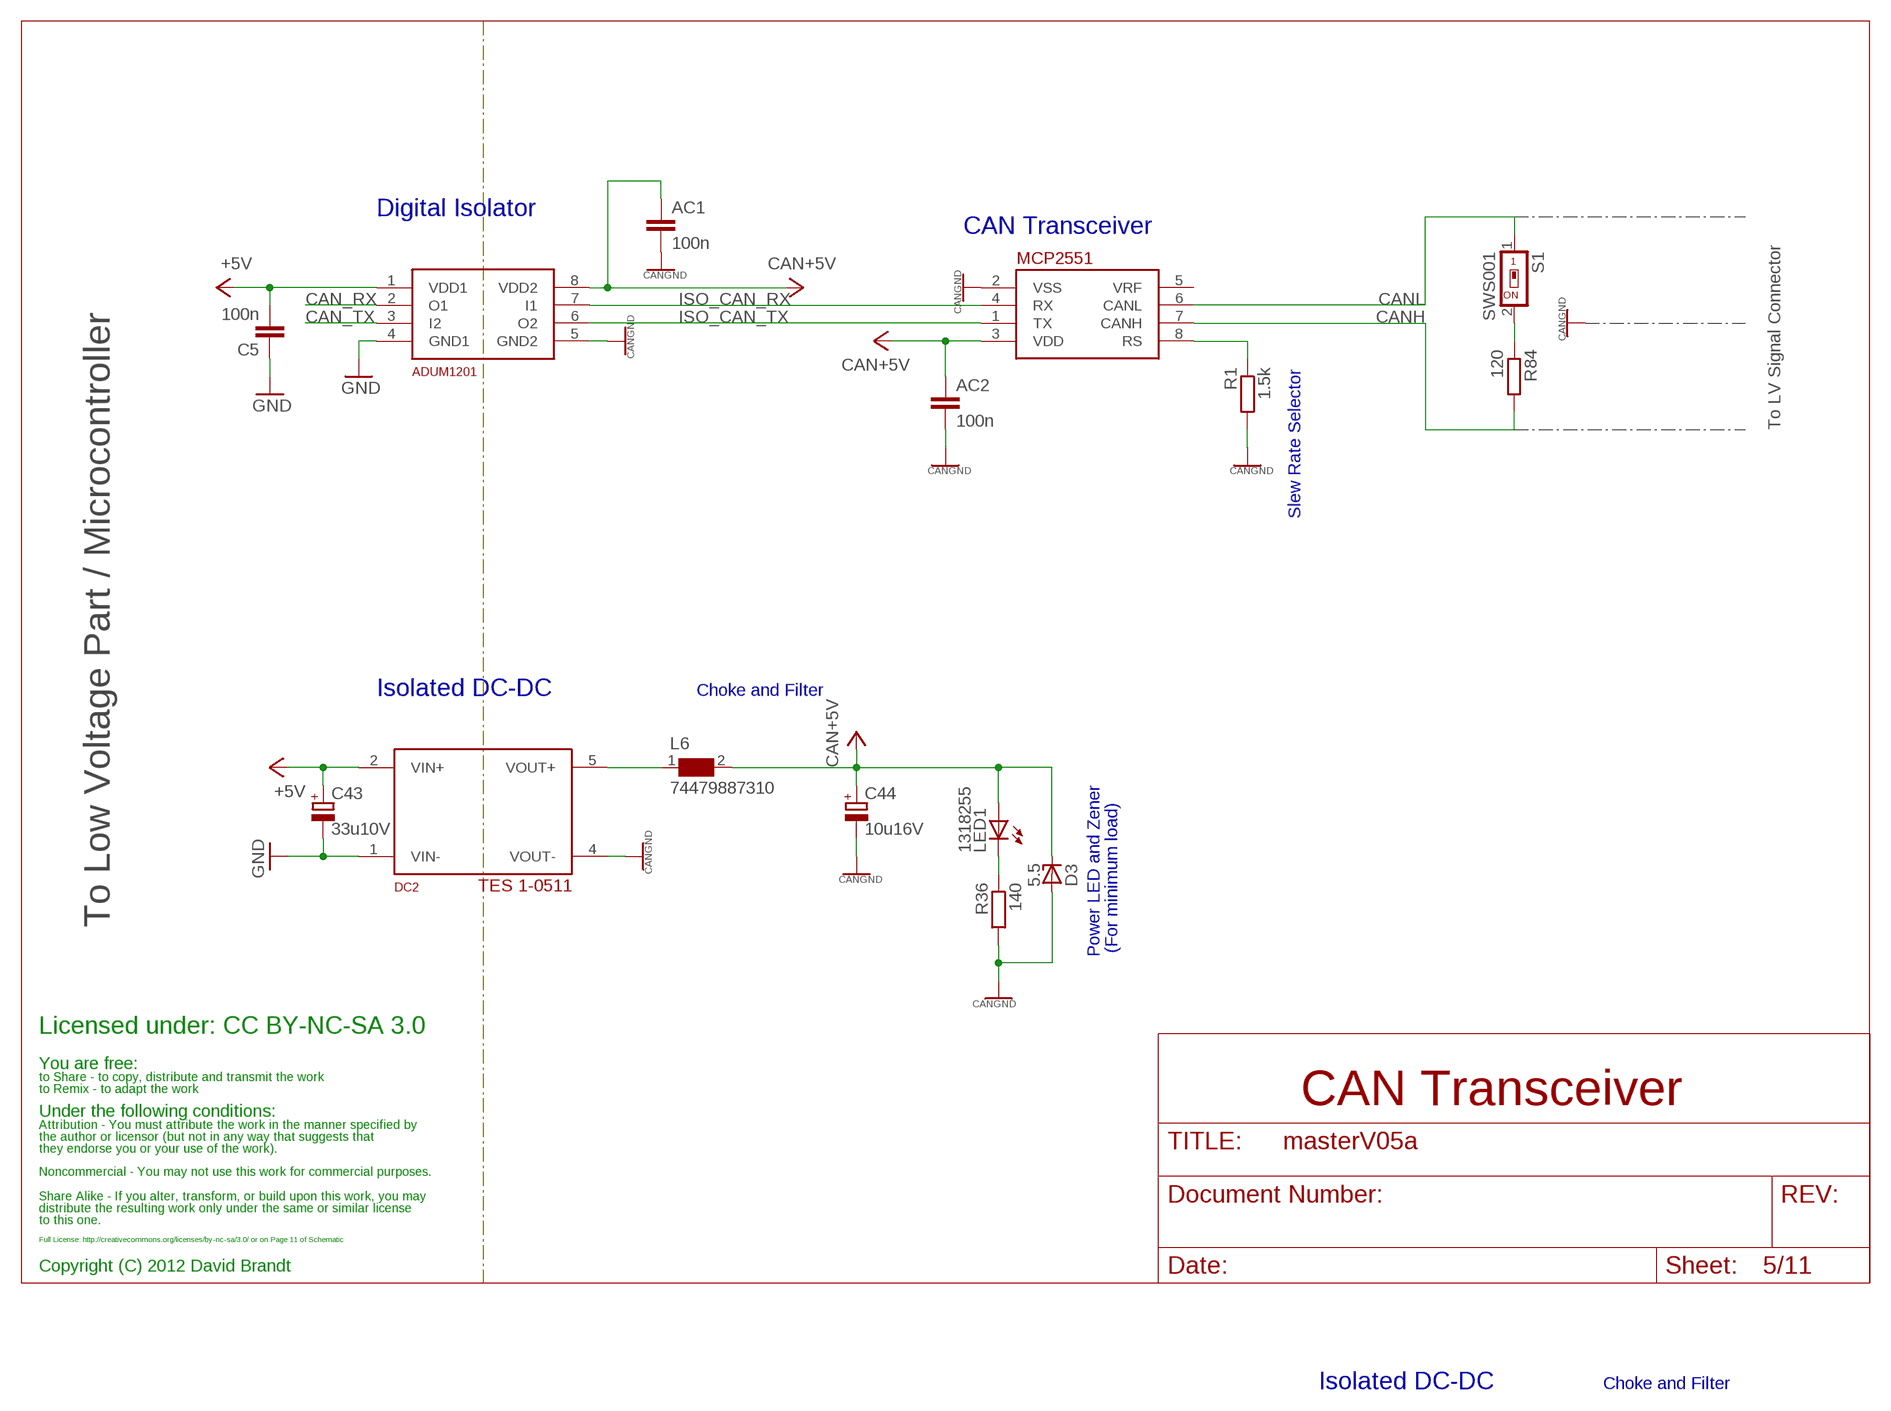
[diagram p4: schematic, sheet 5]

### Parts
AC1  100n  C-EUC0603K  [C0603K]
AC2  100n  C-EUC0603K  [C0603K]
C5  100n  C-EUC0603K  [C0603K]
C43  33u10V  CPOL-EUC  [PANASONIC_C]
C44  10u16V  CPOL-EUB  [PANASONIC_B]
D3  5.5  ZENER-DIODESOD323  [SOD323-W]
DC2  TES 1-0511  ISFXXXXA  [ISF]
L6  74479887310  WE-PMI_1008  [WE-PMI_1008]
LED1  1318255  LEDCHIPLED_1206  [CHIPLED_1206]
R1  1.5k  R-EU_R0603  [R0603]
R36  140  R-EU_R1206  [R1206]
R84  120  R-EU_M1206  [M1206]
S1  SWS001  [SMS-001]
U$17  MCP2551  [SO-8]
U$20  ADUM1201  [SO-8]

### Nets
+5V: C5.2 C43.+ DC2.2(VIN+) U$20.1(VDD1) ; also sheet 1,2,3,4,6,7,8,9,10
C1RS: R1.1 U$17.8(RS)
CAN+5V: AC1.1 AC2.1 C44.+ D3.C L6.2 LED1.A U$17.3(VDD) U$20.8(VDD2)
CAN+5VL: DC2.5(VOUT+) L6.1
CAN_RX: U$20.2(O1) ; also sheet 1
CAN_TX: U$20.3(I2) ; also sheet 1
CANGND: AC1.2 AC2.2 C44.- D3.A DC2.4(VOUT-) R1.2 R36.2 U$17.2(VSS) U$20.5(GND2) ; also sheet 2
CANH: R84.2 U$17.7(CANH) ; also sheet 2
CANL: S1.1 U$17.6(CANL) ; also sheet 2
CANM: R84.1 S1.2
GND: C5.1 C43.- DC2.1(VIN-) U$20.4(GND1) ; also sheet 1,2,3,4,6,7,8,9,10
ISO_CAN_RX: U$17.4(RX) U$20.7(I1)
ISO_CAN_TX: U$17.1(TX) U$20.6(O2)
PLEDC1: LED1.C R36.1
Unconnected: U$17.5(VRF)

### Notes on the sheet
- Digital Isolator
- CAN Transceiver
- To LV Signal Connector
- Slew Rate Selector
- Isolated DC-DC | Choke and Filter
- Power LED and Zener
- (For minimum load)
- To Low Voltage Part / Microcontroller
- Licensed under: CC BY-NC-SA 3.0
- You are free:
- to Share - to copy, distribute and transmit the work
- to Remix - to adapt the work
- CAN Transceiver
- Under the following conditions:
- Attribution - You must attribute the work in the manner specified by
- the author or licensor (but not in any way that suggests that
- they endorse you or your use of the work).
- Noncommercial - You may not use this work for commercial purposes.
- Share Alike - If you alter, transform, or build upon this work, you may
- distribute the resulting work only under the same or similar license
- to this one.
- Full License: http://creativecommons.org/licenses/by-nc-sa/3.0/ or on Page 11 of Schematic
- Copyright (C) 2012 David Brandt
- Isolated DC-DC | Choke and Filter

## Sheet 6 of 11
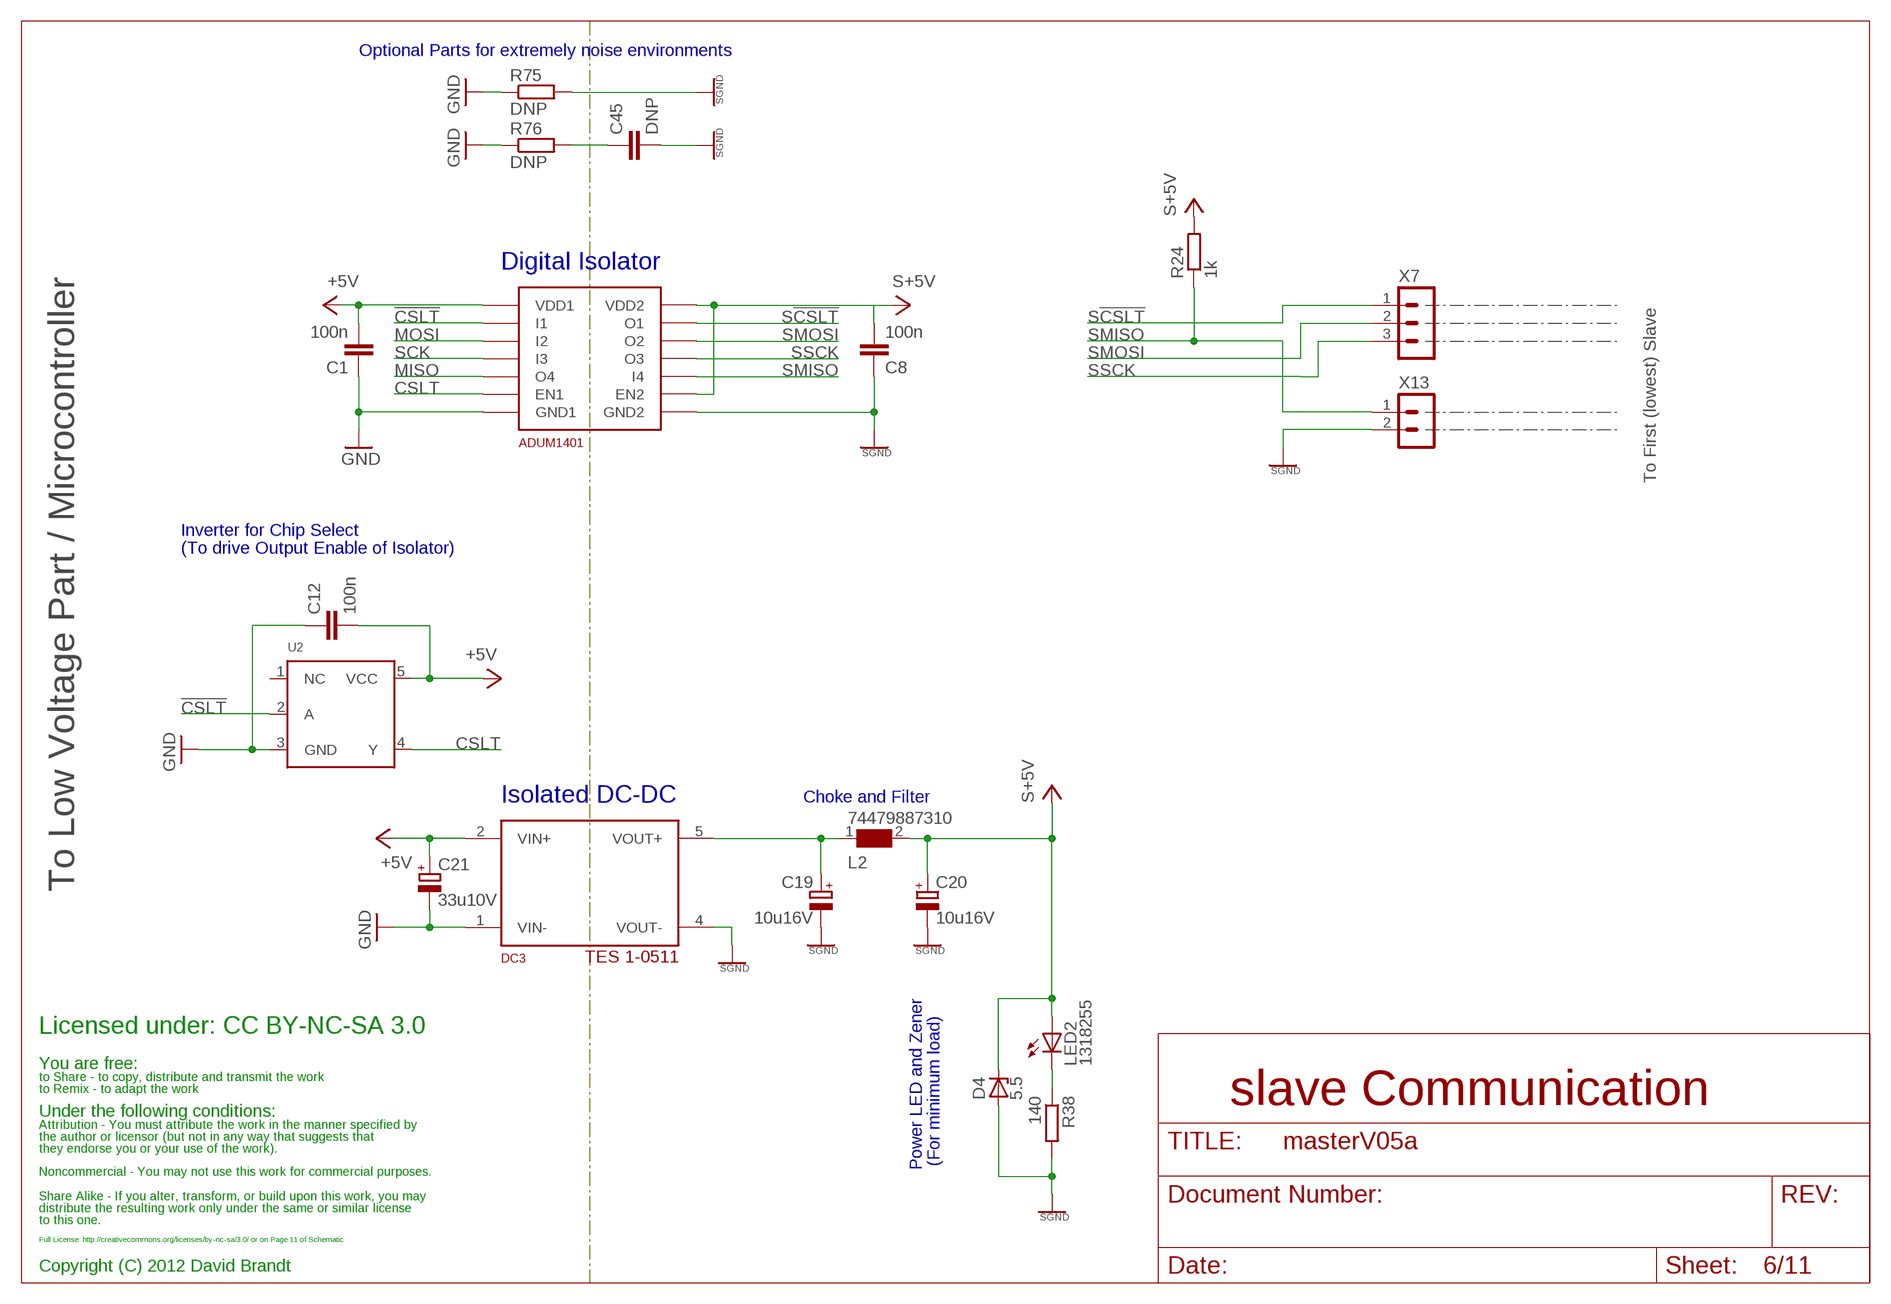
[diagram p5: schematic, sheet 6]

### Parts
C1  100n  C-EUC0603K  [C0603K]
C8  100n  C-EUC0603K  [C0603K]
C12  100n  C-EUC0603K  [C0603K]
C19  10u16V  CPOL-EUB  [PANASONIC_B]
C20  10u16V  CPOL-EUB  [PANASONIC_B]
C21  33u10V  CPOL-EUC  [PANASONIC_C]
C45  DNP  C-EUC2220K  [C2220K]
D4  5.5  ZENER-DIODESOD323  [SOD323-W]
DC3  TES 1-0511  ISFXXXXA  [ISF]
L2  74479887310  WE-PMI_1008  [WE-PMI_1008]
LED2  1318255  LEDCHIPLED_1206  [CHIPLED_1206]
R24  1k  R-EU_R0603  [R0603]
R38  140  R-EU_R1206  [R1206]
R75  DNP  R-EU_R2512  [R2512]
R76  DNP  R-EU_R1206  [R1206]
U2  74LVC1G04  [SOT23-5]
U$9  ADUM1401  [SO16WB]
X7  HEADER_POS3_43650-0315  [43650-0315]
X13  HEADER_POS2_43650-0215  [43650-0215]

### Nets
!CSLT: U2.2(A) U$9.P$3(I1) ; also sheet 1
+5V: C1.2 C12.2 C21.+ DC3.2(VIN+) U2.5(VCC) U$9.P$1(VDD1) ; also sheet 1,2,3,4,5,7,8,9,10
CSLT: U2.4(Y) U$9.P$7(EN1)
GND: C1.1 C12.1 C21.- DC3.1(VIN-) R75.1 R76.1 U2.3(GND) U$9.P$2(GND1) U$9.P$8(GND1) ; also sheet 1,2,3,4,5,7,8,9,10
MISO: U$9.P$6(O4) ; also sheet 1,7,10
MOSI: U$9.P$4(I2) ; also sheet 1,10
PLEDC2: LED2.C R38.1
S!CSLT: U$9.P$14(O1) X7.1
S+5V: C8.2 C20.+ D4.C L2.2 LED2.A R24.2 U$9.P$10(EN2) U$9.P$16(VDD2)
S+5VL: C19.+ DC3.5(VOUT+) L2.1
SCK: U$9.P$5(I3) ; also sheet 1,7,10
SGND: C8.1 C19.- C20.- C45.2 D4.A DC3.4(VOUT-) R38.2 R75.2 U$9.P$9(GND2) U$9.P$15(GND2) X13.2
SGNDGND: C45.1 R76.2
SMISO: R24.1 U$9.P$11(I4) X13.1
SMOSI: U$9.P$13(O2) X7.2
SSCK: U$9.P$12(O3) X7.3
Unconnected: U2.1(NC)

### Notes on the sheet
- Optional Parts for extremely noise environments
- Digital Isolator
- To First (lowest) Slave
- Inverter for Chip Select
- (To drive Output Enable of Isolator)
- Isolated DC-DC | Choke and Filter
- To Low Voltage Part / Microcontroller
- Power LED and Zener
- (For minimum load)
- Licensed under: CC BY-NC-SA 3.0
- You are free:
- to Share - to copy, distribute and transmit the work
- to Remix - to adapt the work
- slave Communication
- Under the following conditions:
- Attribution - You must attribute the work in the manner specified by
- the author or licensor (but not in any way that suggests that
- they endorse you or your use of the work).
- Noncommercial - You may not use this work for commercial purposes.
- Share Alike - If you alter, transform, or build upon this work, you may
- distribute the resulting work only under the same or similar license
- to this one.
- Full License: http://creativecommons.org/licenses/by-nc-sa/3.0/ or on Page 11 of Schematic
- Copyright (C) 2012 David Brandt

## Sheet 7 of 11
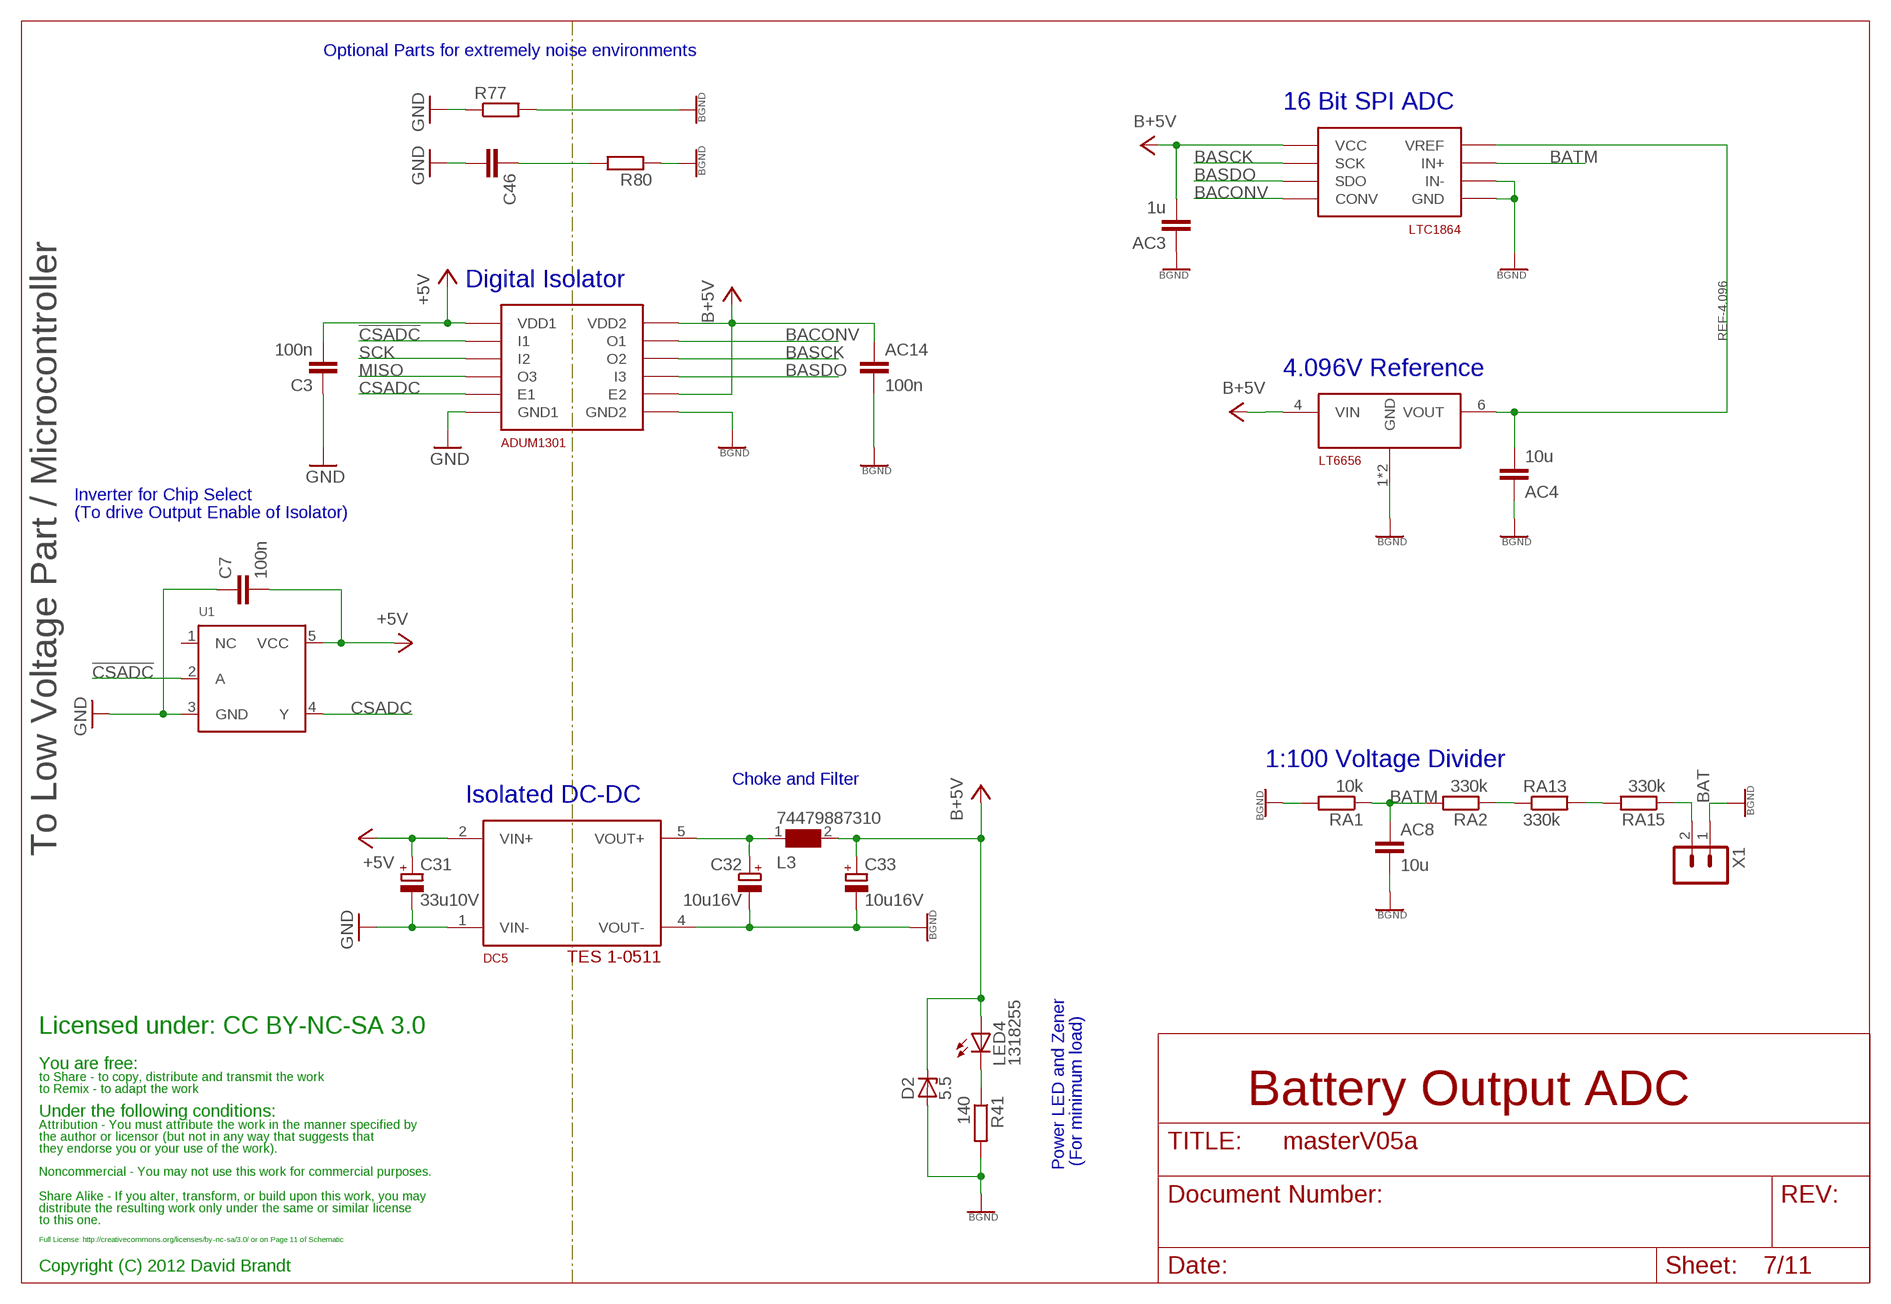
[diagram p6: schematic, sheet 7]

### Parts
AC3  1u  C-EUC1206K  [C1206K]
AC4  10u  C-EUC1206K  [C1206K]
AC8  10u  C-EUC1206K  [C1206K]
AC14  100n  C-EUC0603K  [C0603K]
C3  100n  C-EUC0603K  [C0603K]
C7  100n  C-EUC0603K  [C0603K]
C31  33u10V  CPOL-EUC  [PANASONIC_C]
C32  10u16V  CPOL-EUB  [PANASONIC_B]
C33  10u16V  CPOL-EUB  [PANASONIC_B]
C46  C-EUC2220K  [C2220K]
D2  5.5  ZENER-DIODESOD323  [SOD323-W]
DC5  TES 1-0511  ISFXXXXA  [ISF]
L3  74479887310  WE-PMI_1008  [WE-PMI_1008]
LED4  1318255  LEDCHIPLED_1206  [CHIPLED_1206]
R41  140  R-EU_R1206  [R1206]
R77  R-EU_R2512  [R2512]
R80  R-EU_R1206  [R1206]
RA1  10k  R-EU_M1206  [M1206]
RA2  330k  R-EU_M1206  [M1206]
RA13  330k  R-EU_M1206  [M1206]
RA15  330k  R-EU_M1206  [M1206]
U1  74LVC1G04  [SOT23-5]
U$11  ADUM1301  [SO16WB]
U$14  LT6656  [SOT23-6]
U$16  LTC1864  [MS8]
X1  HEADER_POS2_43650-0215  [43650-0215]

### Nets
!CSADC: U1.2(A) U$11.P$3(I1) ; also sheet 1
+5V: C3.2 C7.2 C31.+ DC5.2(VIN+) U1.5(VCC) U$11.P$1(VDD1) ; also sheet 1,2,3,4,5,6,8,9,10
B+5V: AC3.2 AC14.1 C33.+ D2.C L3.2 LED4.A U$11.P$10(E2) U$11.P$16(VDD2) U$14.4(VIN) U$16.P$8(VCC) ; also sheet 8
B+5VL: C32.+ DC5.5(VOUT+) L3.1
BACONV: U$11.P$14(O1) U$16.P$5(CONV)
BASCK: U$11.P$13(O2) U$16.P$7(SCK)
BASDO: U$11.P$12(I3) U$16.P$6(SDO)
BAT: RA15.1 X1.2 ; also sheet 8
BATM: AC8.1 RA1.1 RA2.2 U$16.P$2(IN+) ; also sheet 8
BATM1: RA2.1 RA13.1
BATM3: RA13.2 RA15.2
BGND: AC3.1 AC4.1 AC8.2 AC14.2 C32.- C33.- D2.A DC5.4(VOUT-) R41.2 R77.2 R80.1 RA1.2 U$11.P$9(GND2) U$11.P$15(GND2) U$14.1(GND) U$14.2(GND) U$16.P$3(IN-) U$16.P$4(GND) X1.1 ; also sheet 8
CSADC: U1.4(Y) U$11.P$7(E1)
GND: C3.1 C7.1 C31.- C46.2 DC5.1(VIN-) R77.1 U1.3(GND) U$11.P$2(GND1) U$11.P$8(GND1) ; also sheet 1,2,3,4,5,6,8,9,10
MISO: U$11.P$5(O3) ; also sheet 1,6,10
PLEDC4: LED4.C R41.1
REF-4.096: AC4.2 U$14.6(VOUT) U$16.P$1(VREF)
SCK: U$11.P$4(I2) ; also sheet 1,6,10
SGNDGND1: C46.1 R80.2
Unconnected: U1.1(NC)

### Notes on the sheet
- Optional Parts for extremely noise environments
- 16 Bit SPI ADC
- Digital Isolator
- 4.096V Reference
- Inverter for Chip Select
- (To drive Output Enable of Isolator)
- 1:100 Voltage Divider
- Choke and Filter
- Isolated DC-DC
- To Low Voltage Part / Microcontroller
- Power LED and Zener
- (For minimum load)
- Licensed under: CC BY-NC-SA 3.0
- You are free:
- to Share - to copy, distribute and transmit the work
- to Remix - to adapt the work
- Battery Output ADC
- Under the following conditions:
- Attribution - You must attribute the work in the manner specified by
- the author or licensor (but not in any way that suggests that
- they endorse you or your use of the work).
- Noncommercial - You may not use this work for commercial purposes.
- Share Alike - If you alter, transform, or build upon this work, you may
- distribute the resulting work only under the same or similar license
- to this one.
- Full License: http://creativecommons.org/licenses/by-nc-sa/3.0/ or on Page 11 of Schematic
- Copyright (C) 2012 David Brandt

## Sheet 8 of 11
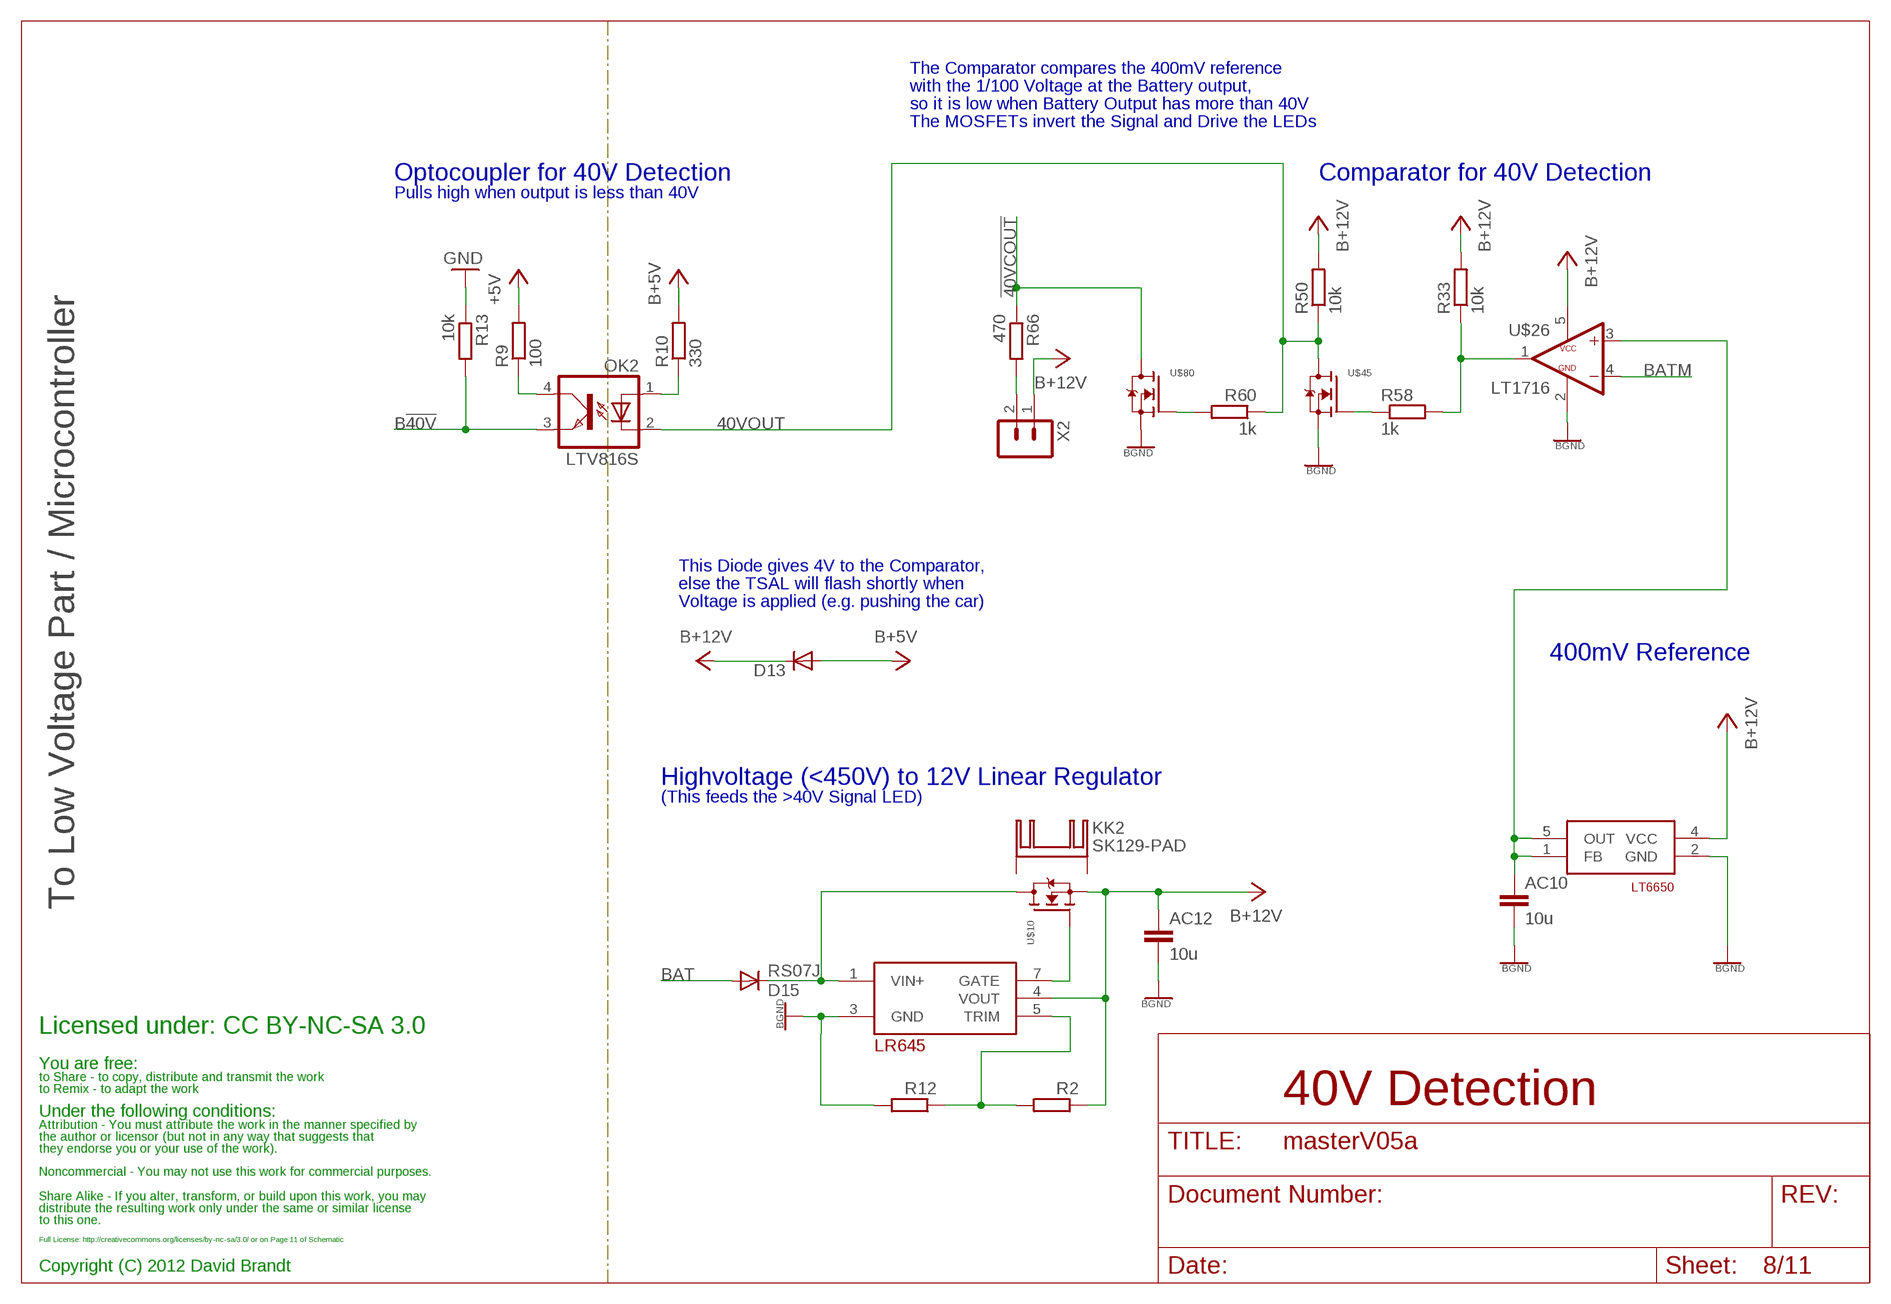
[diagram p7: schematic, sheet 8]

### Parts
AC10  10u  C-EUC1206K  [C1206K]
AC12  10u  C-EUC1206K  [C1206K]
D13  DIODE-SOD323-W  [SOD323-W]
D15  RS07J  [DO-219AB]
KK2  SK129-PAD  [SK129]
OK2  LTV816S  [SMD4]
R2  R-EU_R0805  [R0805]
R9  100  R-EU_R0603  [R0603]
R10  330  R-EU_R0603  [R0603]
R12  R-EU_R0805  [R0805]
R13  10k  R-EU_R0603  [R0603]
R33  10k  R-EU_R0603  [R0603]
R50  10k  R-EU_R0603  [R0603]
R58  1k  R-EU_R0603  [R0603]
R60  1k  R-EU_R0603  [R0603]
R66  470  R-EU_R1206  [R1206]
U$6  LR645  [SO-8]
U$10  DN2540TO220  [TO220V]
U$26  LT1716  [SOT23-5]
U$28  LT6650  [SOT23-5]
U$45  2N7002  [SOT23]
U$80  2N7002  [SOT23]
X2  HEADER_POS2_43650-0215  [43650-0215]

### Nets
40VOUT: OK2.2(C) R50.1 R60.1 U$45.3(D)
!40VCOUT: R66.1 U$80.3(D)
!40VCOUTW: R33.1 R58.2 U$26.1(OUT)
+5V: R9.2 ; also sheet 1,2,3,4,5,6,7,9,10
AVREF400MV: AC10.1 U$26.3(+IN) U$28.1(FB) U$28.5(OUT)
B!40V: OK2.3(EMIT) R13.2 ; also sheet 1,3,4
B!40VE: OK2.4(COL) R9.1
B+5V: D13.A R10.2 ; also sheet 7
B+12V: AC12.1 D13.C R2.1 R33.2 R50.2 U$6.4(VOUT) U$10.3(S) U$26.5(+5V) U$28.4(VCC) X2.1
BAT: D15.A ; also sheet 7
BATD: D15.C U$6.1(VIN+) U$10.2(D)
BATM: U$26.4(-IN) ; also sheet 7
BGND: AC10.2 AC12.2 R12.2 U$6.3(GND) U$26.2(GND) U$28.2(GND) U$45.2(S) U$80.2(S) ; also sheet 7
GND: R13.1 ; also sheet 1,2,3,4,5,6,7,9,10
LR645_G: U$6.7(GATE) U$10.1(G)
LR645_TRIM: R2.2 R12.1 U$6.5(TRIM)
N$8: R58.1 U$45.1(G)
N$9: R60.2 U$80.1(G)
N$11: R66.2 X2.2
OK2A: OK2.1(A) R10.1
Unconnected: KK2.A2,5(K) KK2.B2,5(K)

### Notes on the sheet
- The Comparator compares the 400mV reference
- with the 1/100 Voltage at the Battery output,
- so it is low when Battery Output has more than 40V
- The MOSFETs invert the Signal and Drive the LEDs
- Optocoupler for 40V Detection | Comparator for 40V Detection
- Pulls high when output is less than 40V
- This Diode gives 4V to the Comparator,
- else the TSAL will flash shortly when
- Voltage is applied (e.g. pushing the car)
- 400mV Reference
- Highvoltage (<450V) to 12V Linear Regulator
- (This feeds the >40V Signal LED)
- To Low Voltage Part / Microcontroller
- Licensed under: CC BY-NC-SA 3.0
- You are free:
- to Share - to copy, distribute and transmit the work
- to Remix - to adapt the work
- 40V Detection
- Under the following conditions:
- Attribution - You must attribute the work in the manner specified by
- the author or licensor (but not in any way that suggests that
- they endorse you or your use of the work).
- Noncommercial - You may not use this work for commercial purposes.
- Share Alike - If you alter, transform, or build upon this work, you may
- distribute the resulting work only under the same or similar license
- to this one.
- Full License: http://creativecommons.org/licenses/by-nc-sa/3.0/ or on Page 11 of Schematic
- Copyright (C) 2012 David Brandt

## Sheet 9 of 11
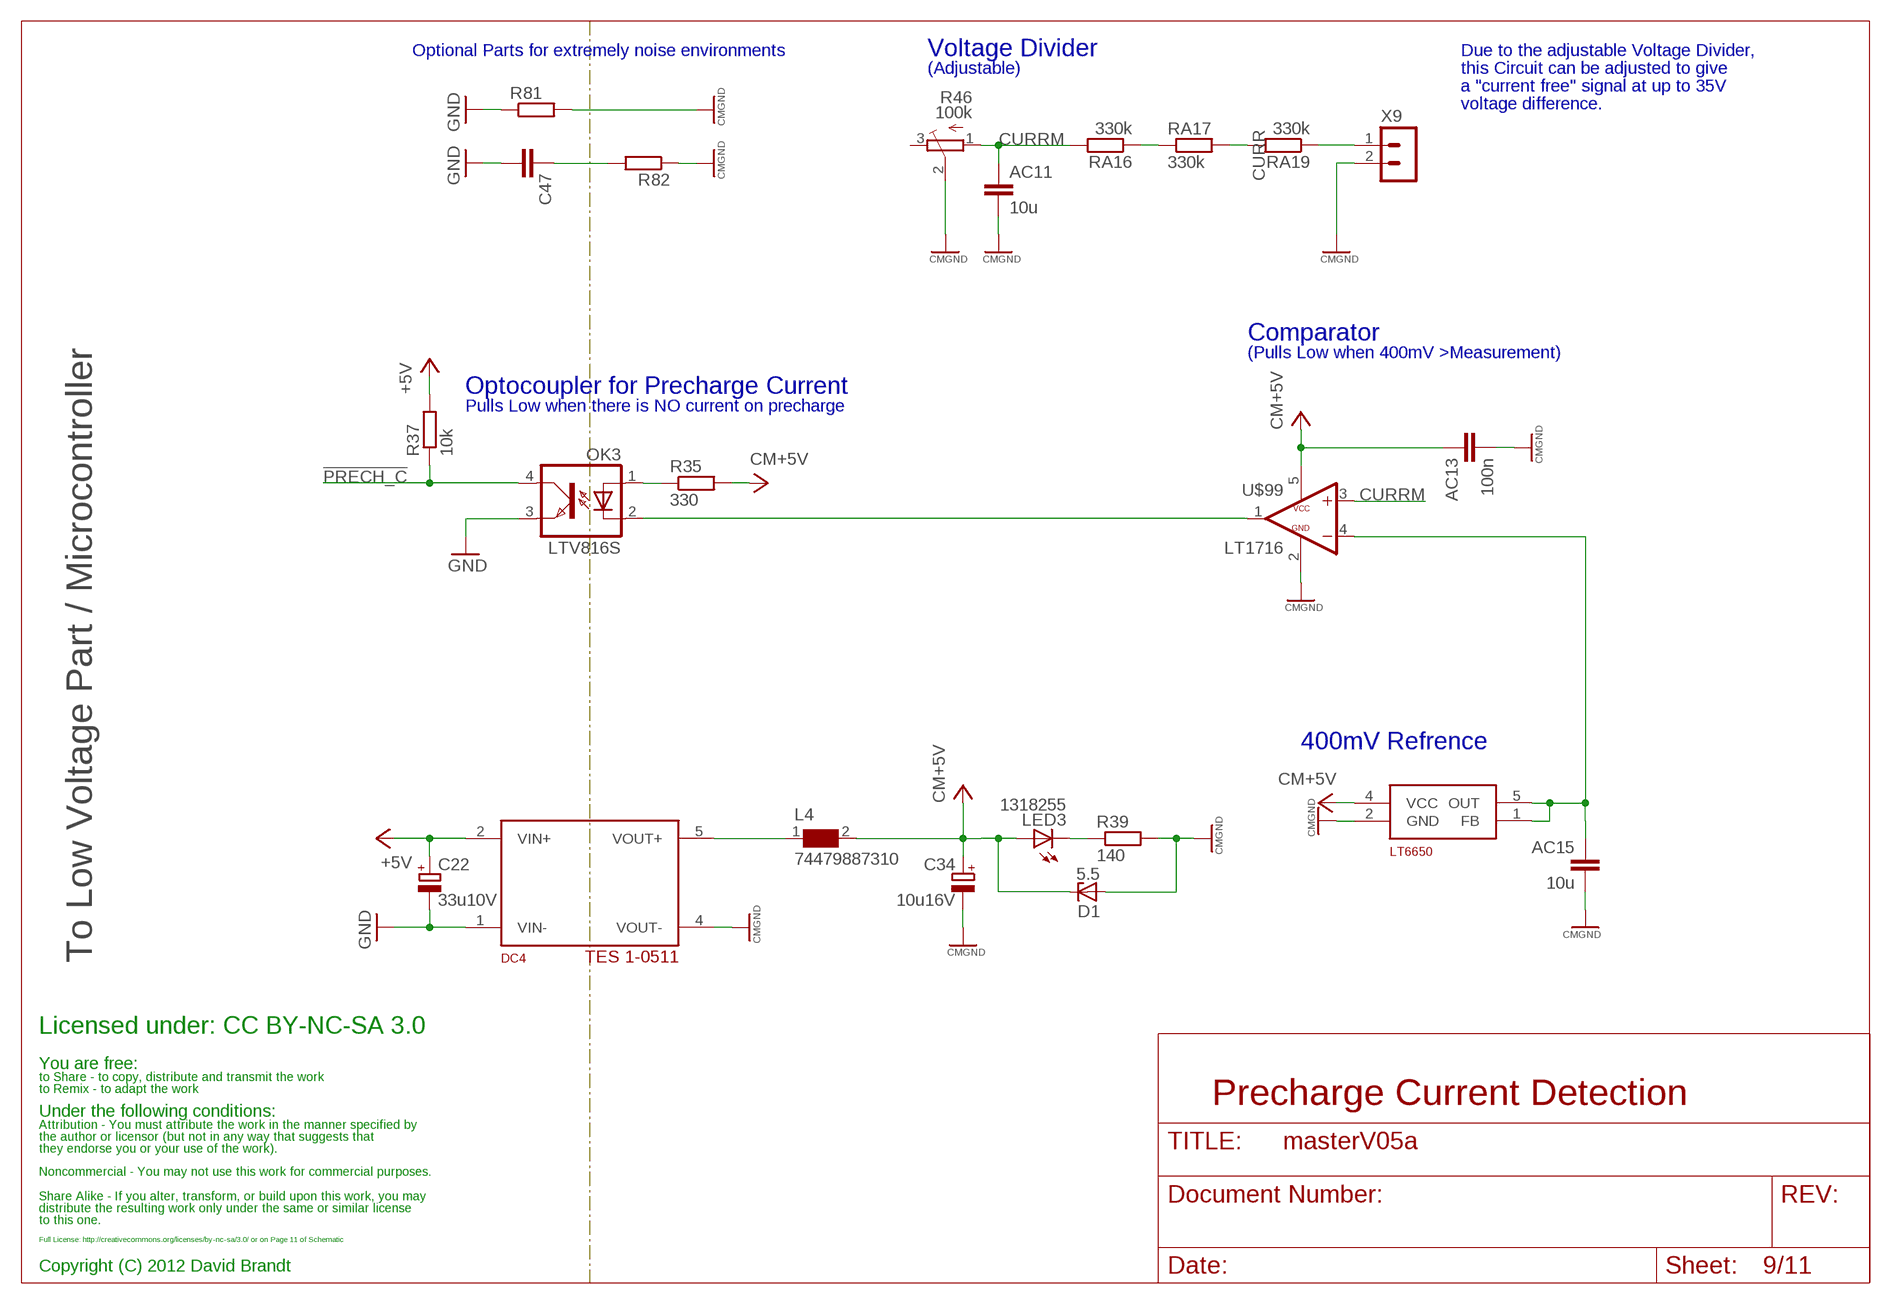
[diagram p8: schematic, sheet 9]

### Parts
AC11  10u  C-EUC1206K  [C1206K]
AC13  100n  C-EUC0603K  [C0603K]
AC15  10u  C-EUC1206K  [C1206K]
C22  33u10V  CPOL-EUC  [PANASONIC_C]
C34  10u16V  CPOL-EUB  [PANASONIC_B]
C47  C-EUC2220K  [C2220K]
D1  5.5  ZENER-DIODESOD323  [SOD323-W]
DC4  TES 1-0511  ISFXXXXA  [ISF]
L4  74479887310  WE-PMI_1008  [WE-PMI_1008]
LED3  1318255  LEDCHIPLED_1206  [CHIPLED_1206]
OK3  LTV816S  [SMD4]
R35  330  R-EU_R0603  [R0603]
R37  10k  R-EU_R0603  [R0603]
R39  140  R-EU_R1206  [R1206]
R46  100k  TRIM_EU-3223W  [3223W]
R81  R-EU_R2512  [R2512]
R82  R-EU_R1206  [R1206]
RA16  330k  R-EU_M1206  [M1206]
RA17  330k  R-EU_M1206  [M1206]
RA19  330k  R-EU_M1206  [M1206]
U$99  LT1716  [SOT23-5]
U$101  LT6650  [SOT23-5]
X9  HEADER_POS2_43650-0215  [43650-0215]

### Nets
!PRECH_C: OK3.4(COL) R37.1 ; also sheet 1,3
+5V: C22.+ DC4.2(VIN+) R37.2 ; also sheet 1,2,3,4,5,6,7,8,10
AVREF3: AC15.1 U$99.4(-IN) U$101.1(FB) U$101.5(OUT)
CM+5V: AC13.1 C34.+ D1.C L4.2 LED3.A R35.2 U$99.5(+5V) U$101.4(VCC)
CM+5VL: DC4.5(VOUT+) L4.1
CMGND: AC11.2 AC13.2 AC15.2 C34.- D1.A DC4.4(VOUT-) R39.2 R46.2(S) R81.2 R82.1 U$99.2(GND) U$101.2(GND) X9.2
CURR: RA19.1 X9.1
CURRM: AC11.1 R46.1(A) RA16.2 U$99.3(+IN)
CURRM4: RA16.1 RA17.1
CURRM7: RA17.2 RA19.2
GND: C22.- C47.2 DC4.1(VIN-) OK3.3(EMIT) R81.1 ; also sheet 1,2,3,4,5,6,7,8,10
OPTOLED: OK3.1(A) R35.1
PLEDC3: LED3.C R39.1
PRECHARGEOPTO: OK3.2(C) U$99.1(OUT)
SGNDGND2: C47.1 R82.2
Unconnected: R46.3(E)

### Notes on the sheet
- Optional Parts for extremely noise environments | Voltage Divider | Due to the adjustable Voltage Divider,
- (Adjustable) | this Circuit can be adjusted to give
- a "current free" signal at up to 35V
- voltage difference.
- Comparator
- (Pulls Low when 400mV >Measurement)
- Optocoupler for Precharge Current
- Pulls Low when there is NO current on precharge
- 400mV Refrence
- To Low Voltage Part / Microcontroller
- Licensed under: CC BY-NC-SA 3.0
- You are free:
- to Share - to copy, distribute and transmit the work
- to Remix - to adapt the work
- Precharge Current Detection
- Under the following conditions:
- Attribution - You must attribute the work in the manner specified by
- the author or licensor (but not in any way that suggests that
- they endorse you or your use of the work).
- Noncommercial - You may not use this work for commercial purposes.
- Share Alike - If you alter, transform, or build upon this work, you may
- distribute the resulting work only under the same or similar license
- to this one.
- Full License: http://creativecommons.org/licenses/by-nc-sa/3.0/ or on Page 11 of Schematic
- Copyright (C) 2012 David Brandt

## Sheet 10 of 11
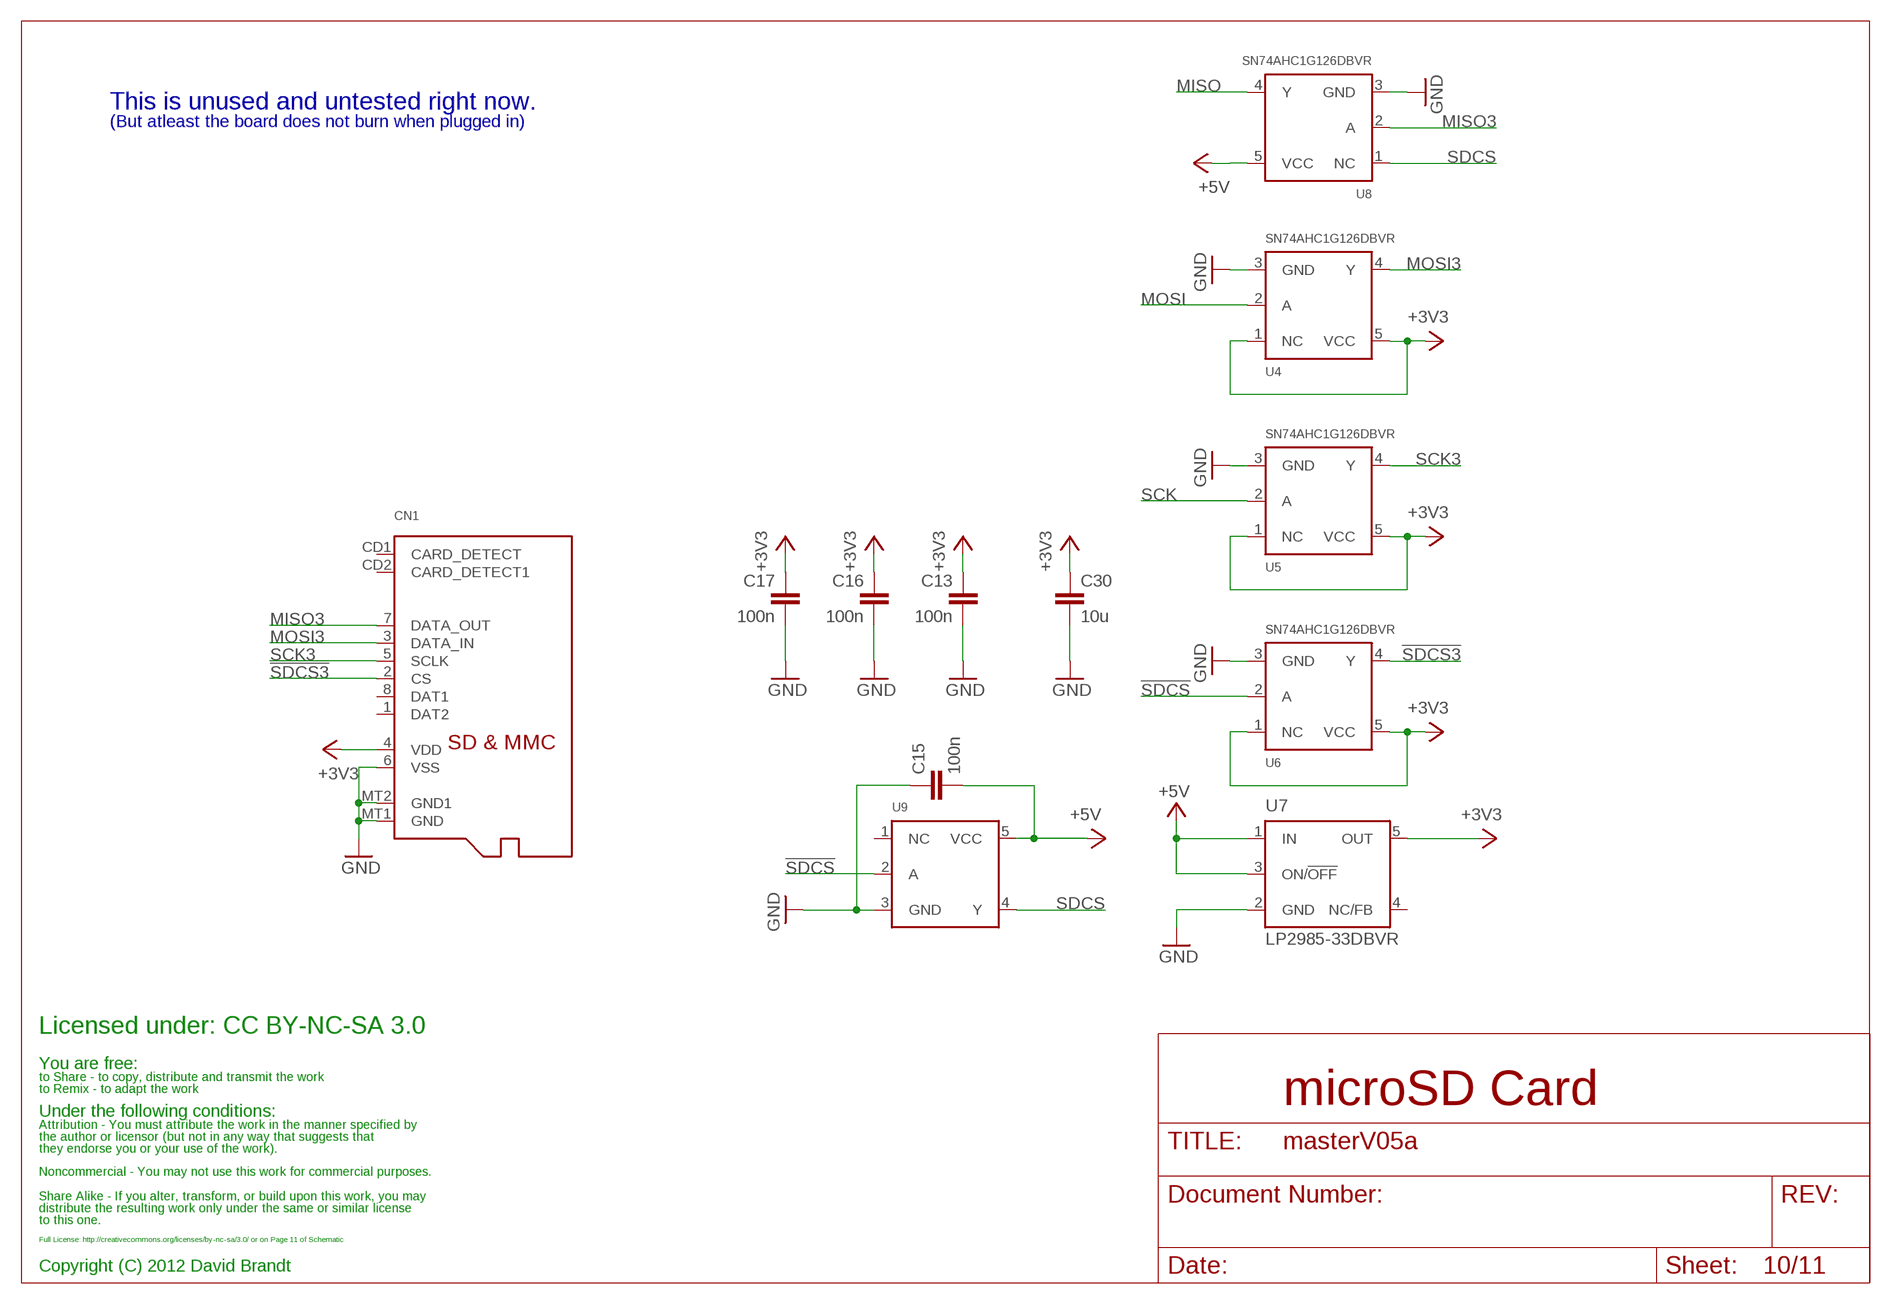
[diagram p9: schematic, sheet 10]

### Parts
C13  100n  C-EUC0603  [C0603]
C15  100n  C-EUC0603K  [C0603K]
C16  100n  C-EUC0603  [C0603]
C17  100n  C-EUC0603  [C0603]
C30  10u  C-EUC1206  [C1206]
CN1  MICROSD  [MICROSD]
U4  SN74AHC1G126DBVR  74LVC1G04  [SOT23-5]
U5  SN74AHC1G126DBVR  74LVC1G04  [SOT23-5]
U6  SN74AHC1G126DBVR  74LVC1G04  [SOT23-5]
U7  LP2985-33DBVR  LP2985-XXDBVR33  [SOT23-DBV]
U8  SN74AHC1G126DBVR  74LVC1G04  [SOT23-5]
U9  74LVC1G04  [SOT23-5]

### Nets
!SDCS: U6.2(A) U9.2(A) ; also sheet 1
!SDCS3: CN1.2(CS) U6.4(Y)
+3V3: C13.1 C16.1 C17.1 C30.1 CN1.4(VDD) U4.1(NC) U4.5(VCC) U5.1(NC) U5.5(VCC) U6.1(NC) U6.5(VCC) U7.5(OUT)
+5V: C15.2 U7.1(IN) U7.3(ON/!OFF) U8.5(VCC) U9.5(VCC) ; also sheet 1,2,3,4,5,6,7,8,9
GND: C13.2 C15.1 C16.2 C17.2 C30.2 CN1.6(VSS) CN1.MT1(GND) CN1.MT2(GND1) U4.3(GND) U5.3(GND) U6.3(GND) U7.2(GND) U8.3(GND) U9.3(GND) ; also sheet 1,2,3,4,5,6,7,8,9
MISO: U8.4(Y) ; also sheet 1,6,7
MISO3: CN1.7(DATA_OUT) U8.2(A)
MOSI: U4.2(A) ; also sheet 1,6
MOSI3: CN1.3(DATA_IN) U4.4(Y)
SCK: U5.2(A) ; also sheet 1,6,7
SCK3: CN1.5(SCLK) U5.4(Y)
SDCS: U8.1(NC) U9.4(Y)
Unconnected: CN1.1(DAT2) CN1.8(DAT1) CN1.CD1(CARD_DETECT) CN1.CD2(CARD_DETECT1) U7.4(NC/FB) U9.1(NC)

### Notes on the sheet
- This is unused and untested right now.
- (But atleast the board does not burn when plugged in)
- Licensed under: CC BY-NC-SA 3.0
- You are free:
- to Share - to copy, distribute and transmit the work
- to Remix - to adapt the work
- microSD Card
- Under the following conditions:
- Attribution - You must attribute the work in the manner specified by
- the author or licensor (but not in any way that suggests that
- they endorse you or your use of the work).
- Noncommercial - You may not use this work for commercial purposes.
- Share Alike - If you alter, transform, or build upon this work, you may
- distribute the resulting work only under the same or similar license
- to this one.
- Full License: http://creativecommons.org/licenses/by-nc-sa/3.0/ or on Page 11 of Schematic
- Copyright (C) 2012 David Brandt